# EasyEDA Pro project 1 Port AC Power Switch.eprj, schematic with Switch Detect

## Sheets
1 AC Power: Board Name: V3.0.1 Pro; Create Date: 2026-05-05; Page Name: AC Power; Project Name: 1 Port AC Power Switch; Schematic Name: with Switch Detect; Update Date: 2026-05-09
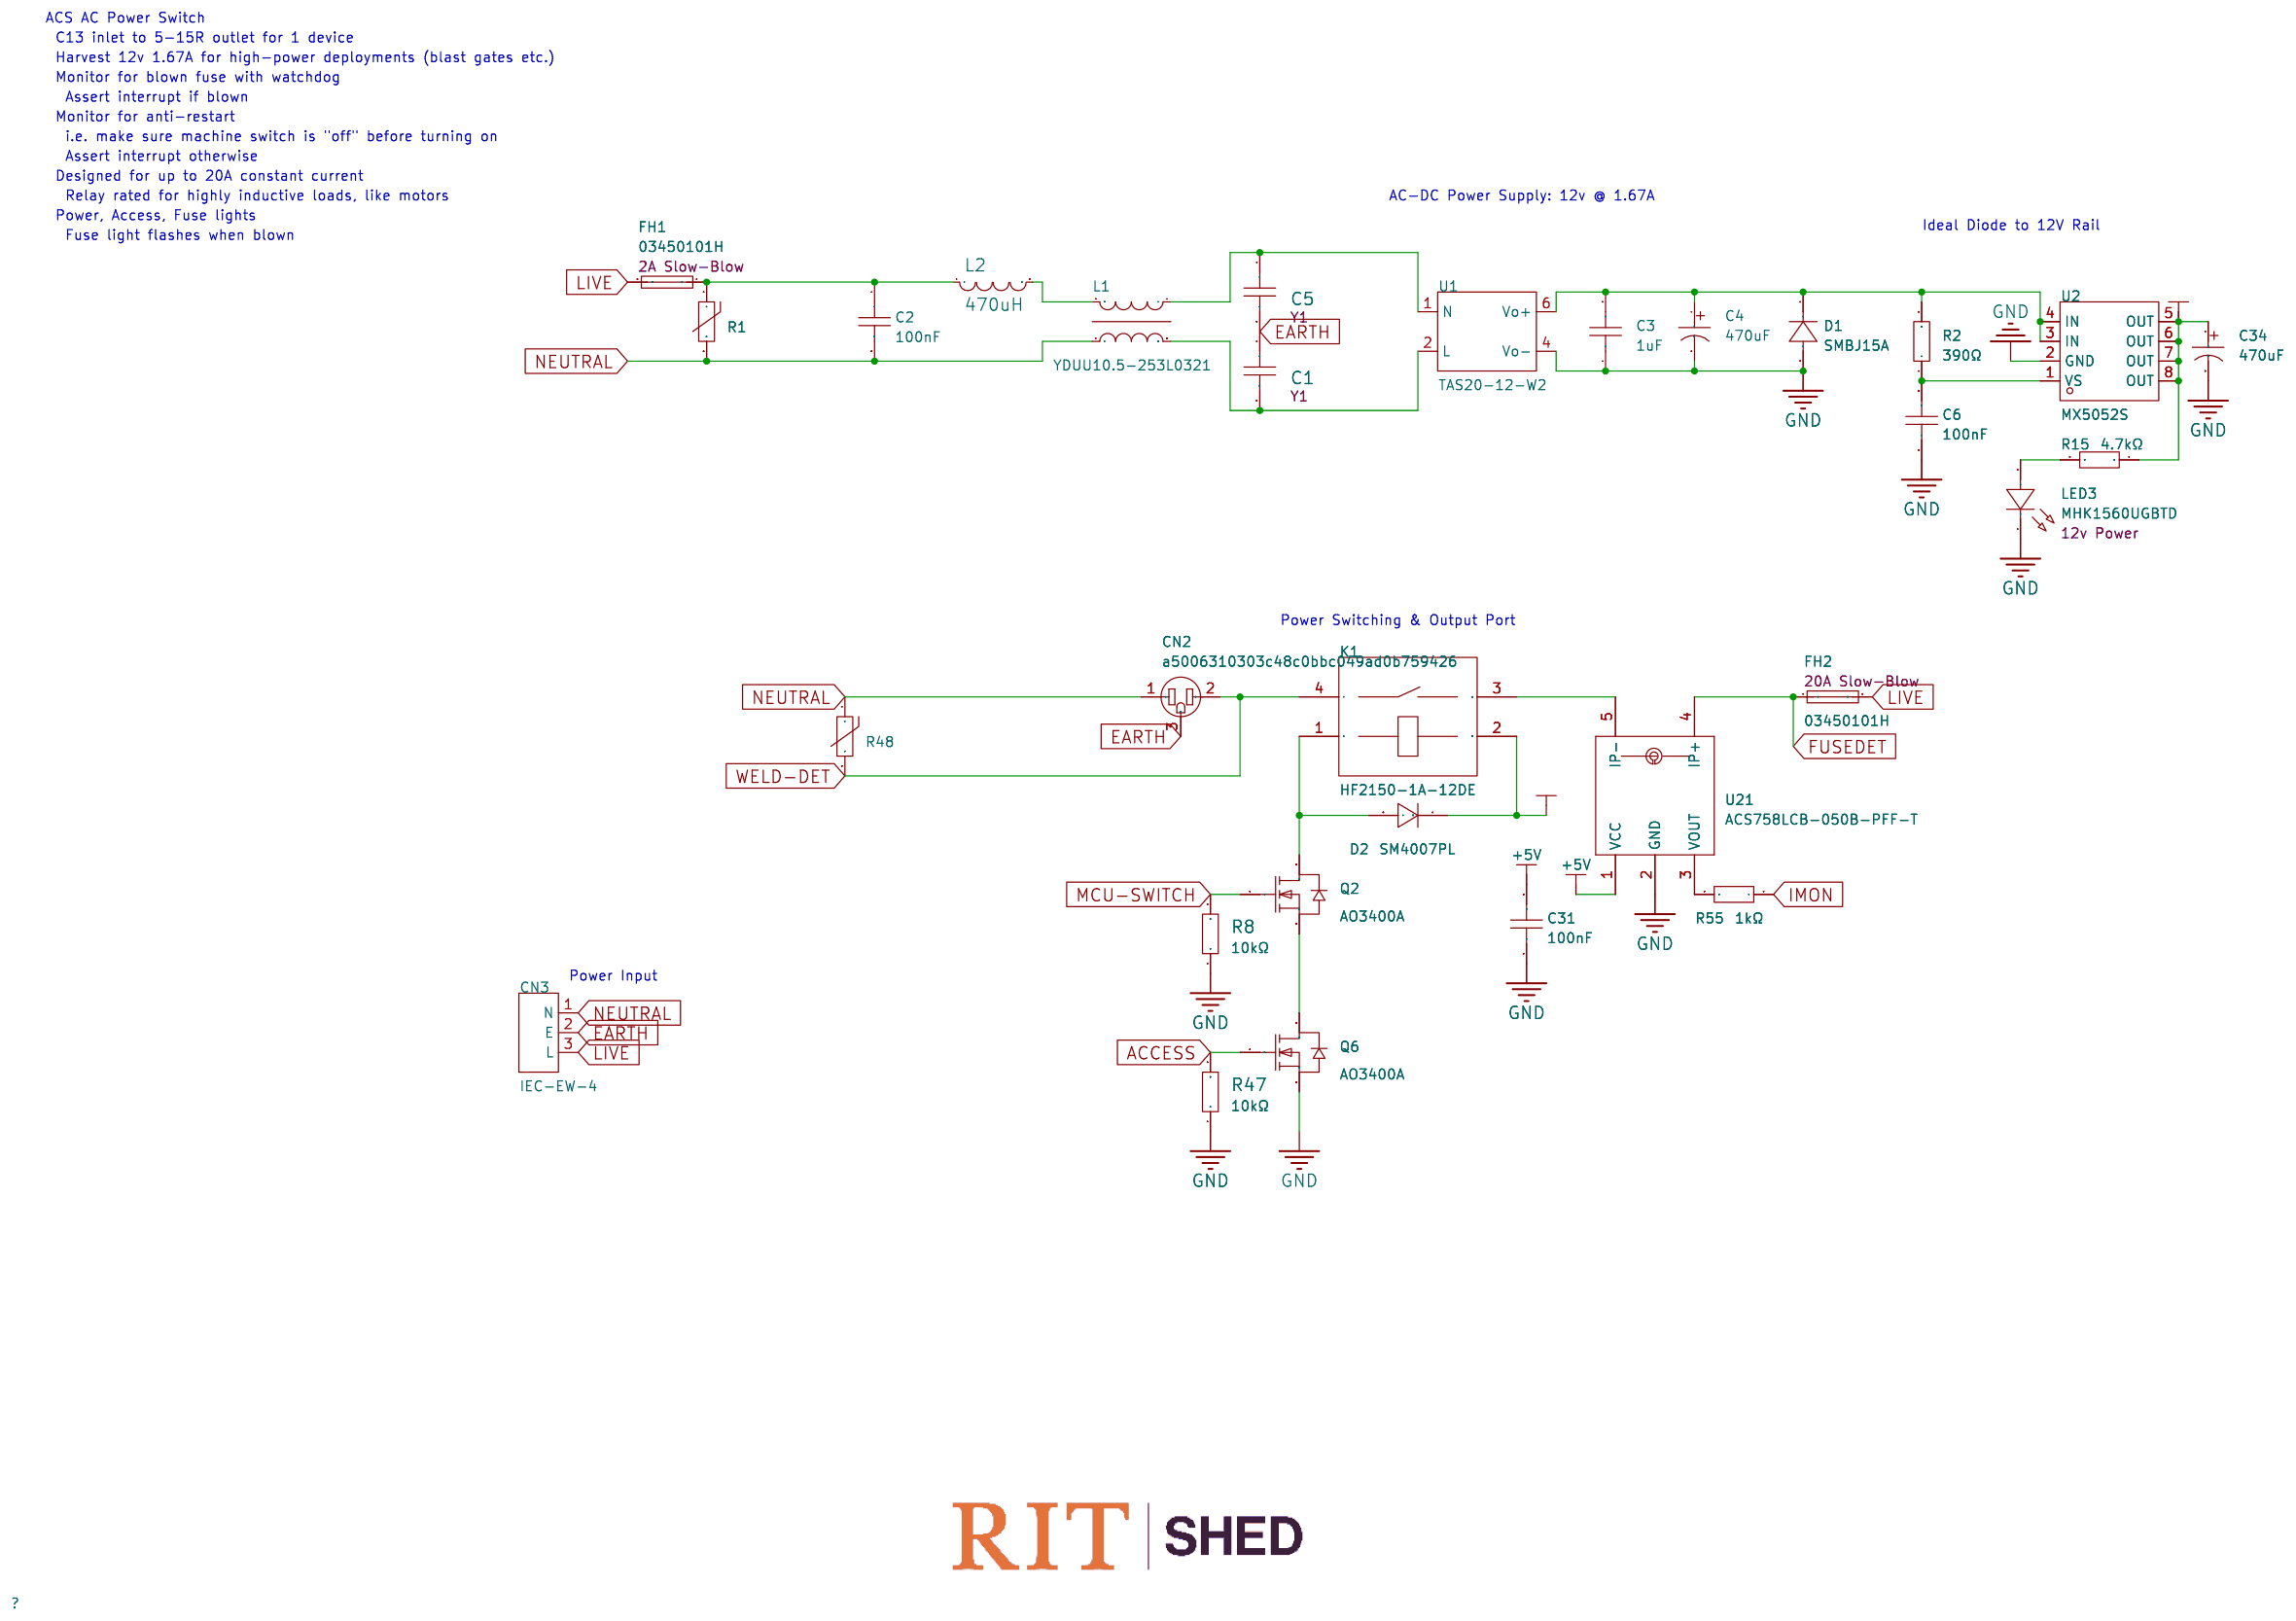
[diagram p2: AC Power]
2 Blown Fuse Detect: Page Name: Blown Fuse Detect; Update Date: 2026-05-07; Company: EasyEDA.com; Page Size: A4; Version: V1.0
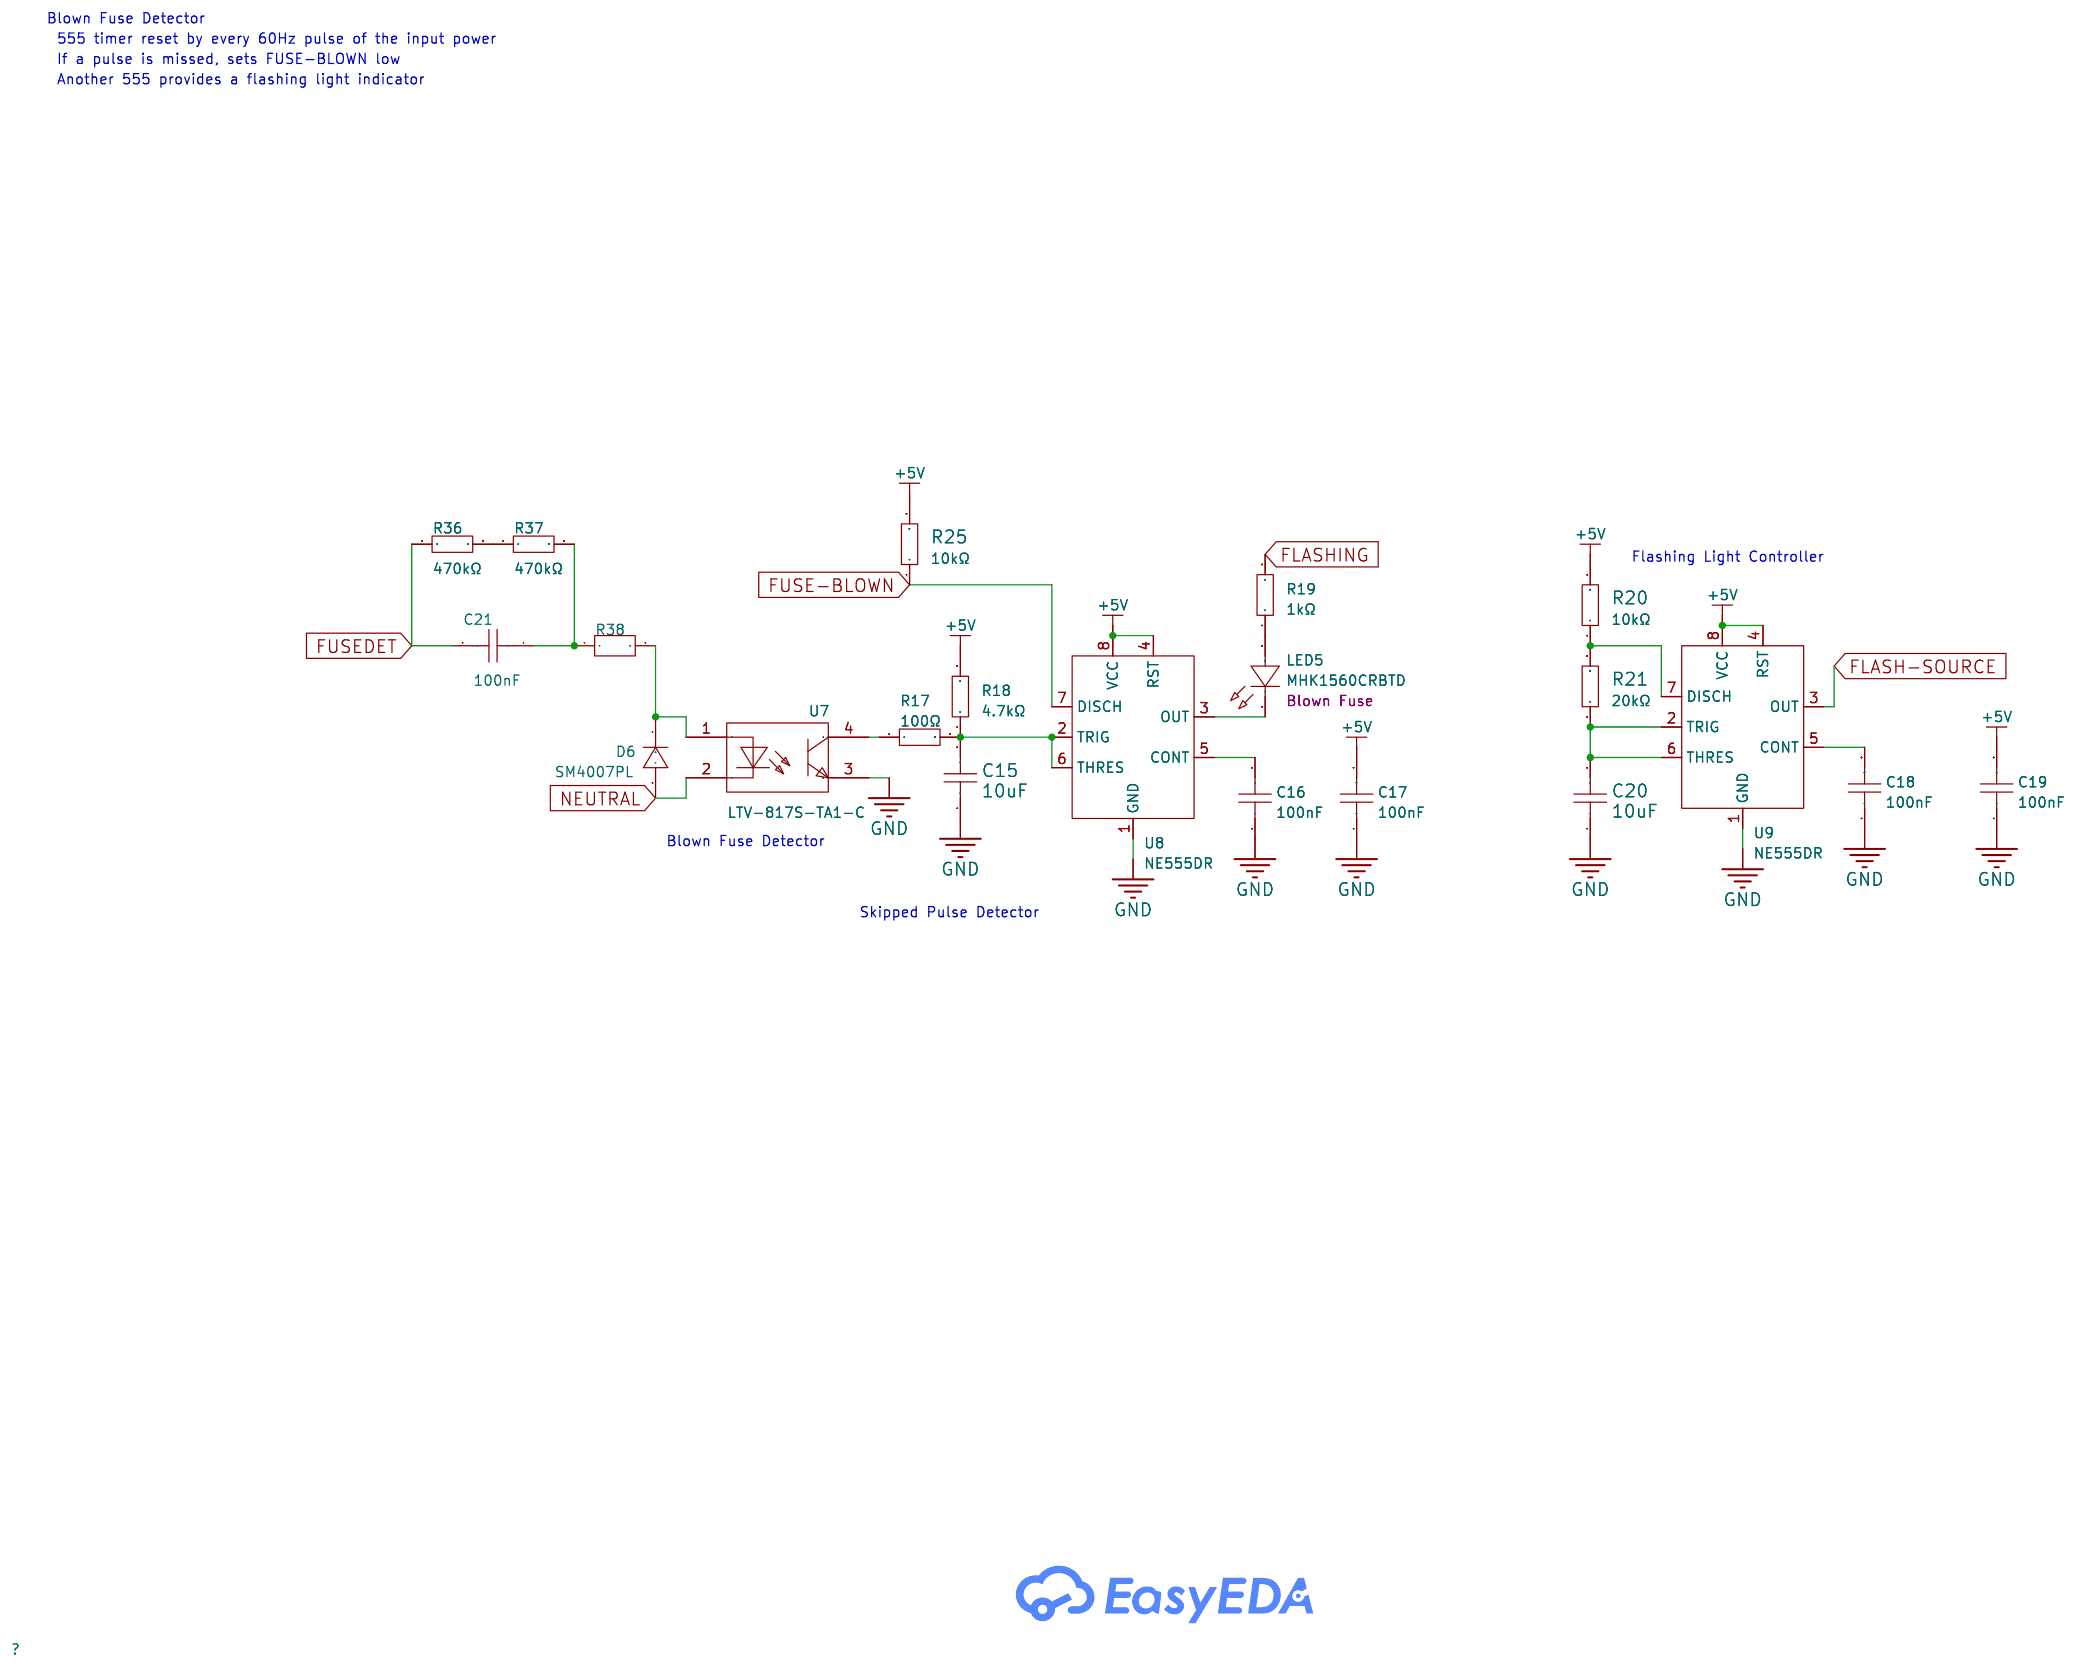
[diagram p3: Blown Fuse Detect]
3 Interfaces: Page Name: Interfaces; Company: EasyEDA.com; Page Size: A4; Version: V1.0
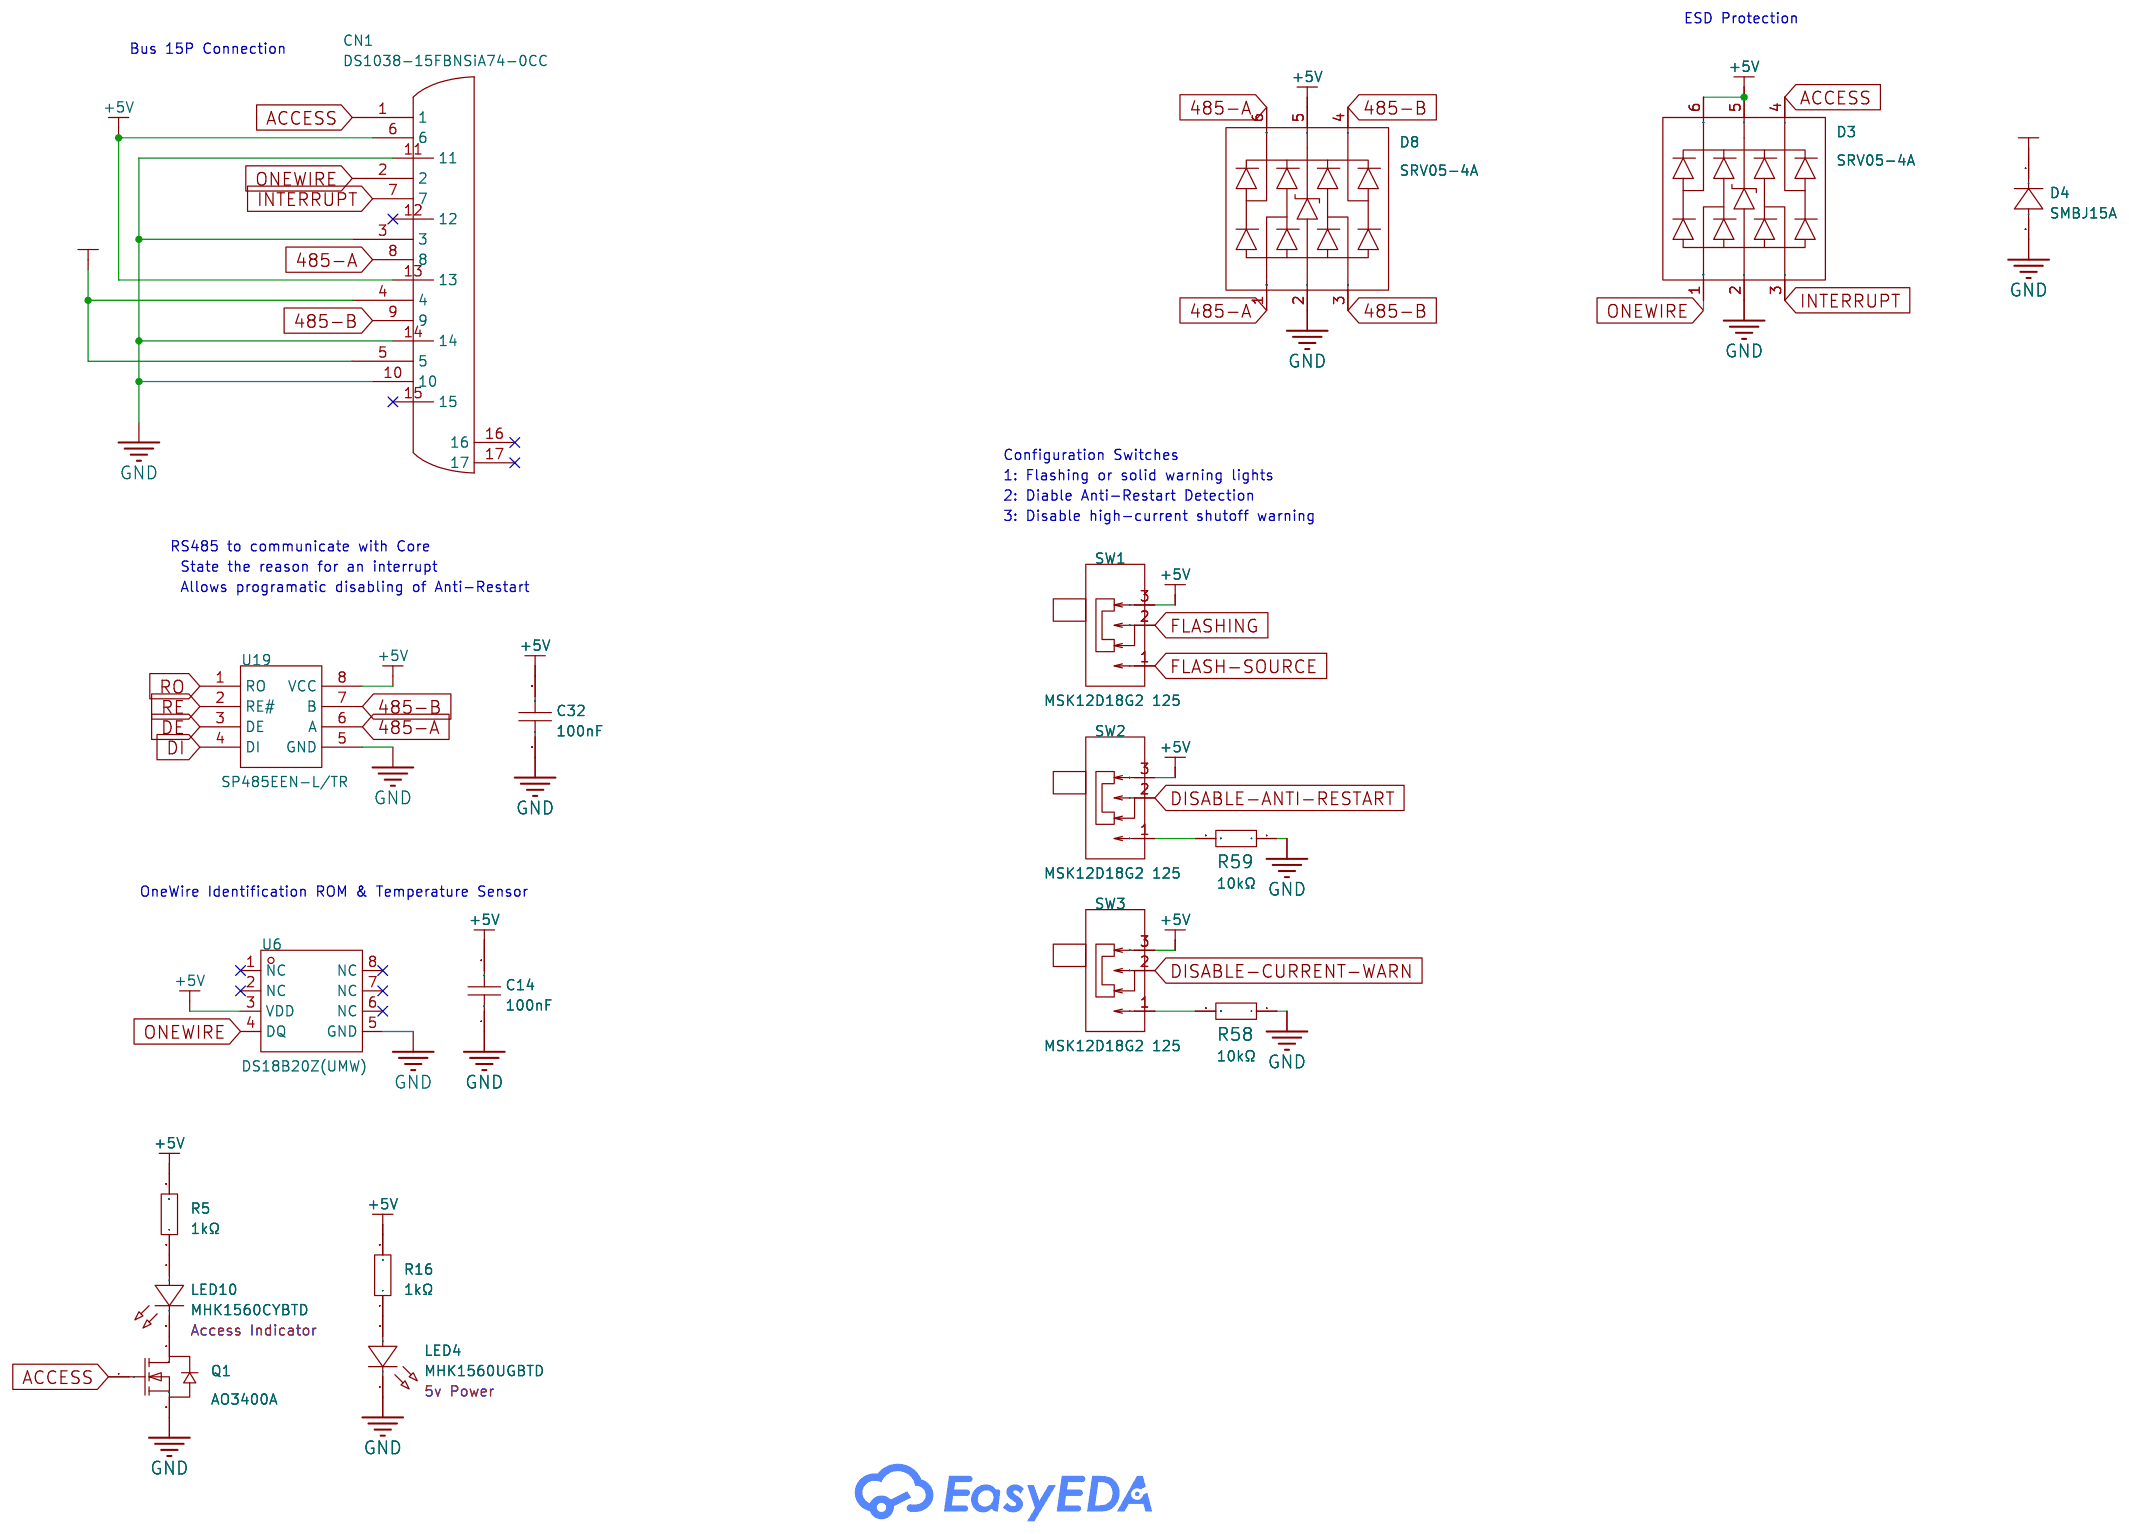
[diagram p4: Interfaces]
4 Control Logic: Page Name: Control Logic; Company: EasyEDA.com; Page Size: A4; Version: V1.0
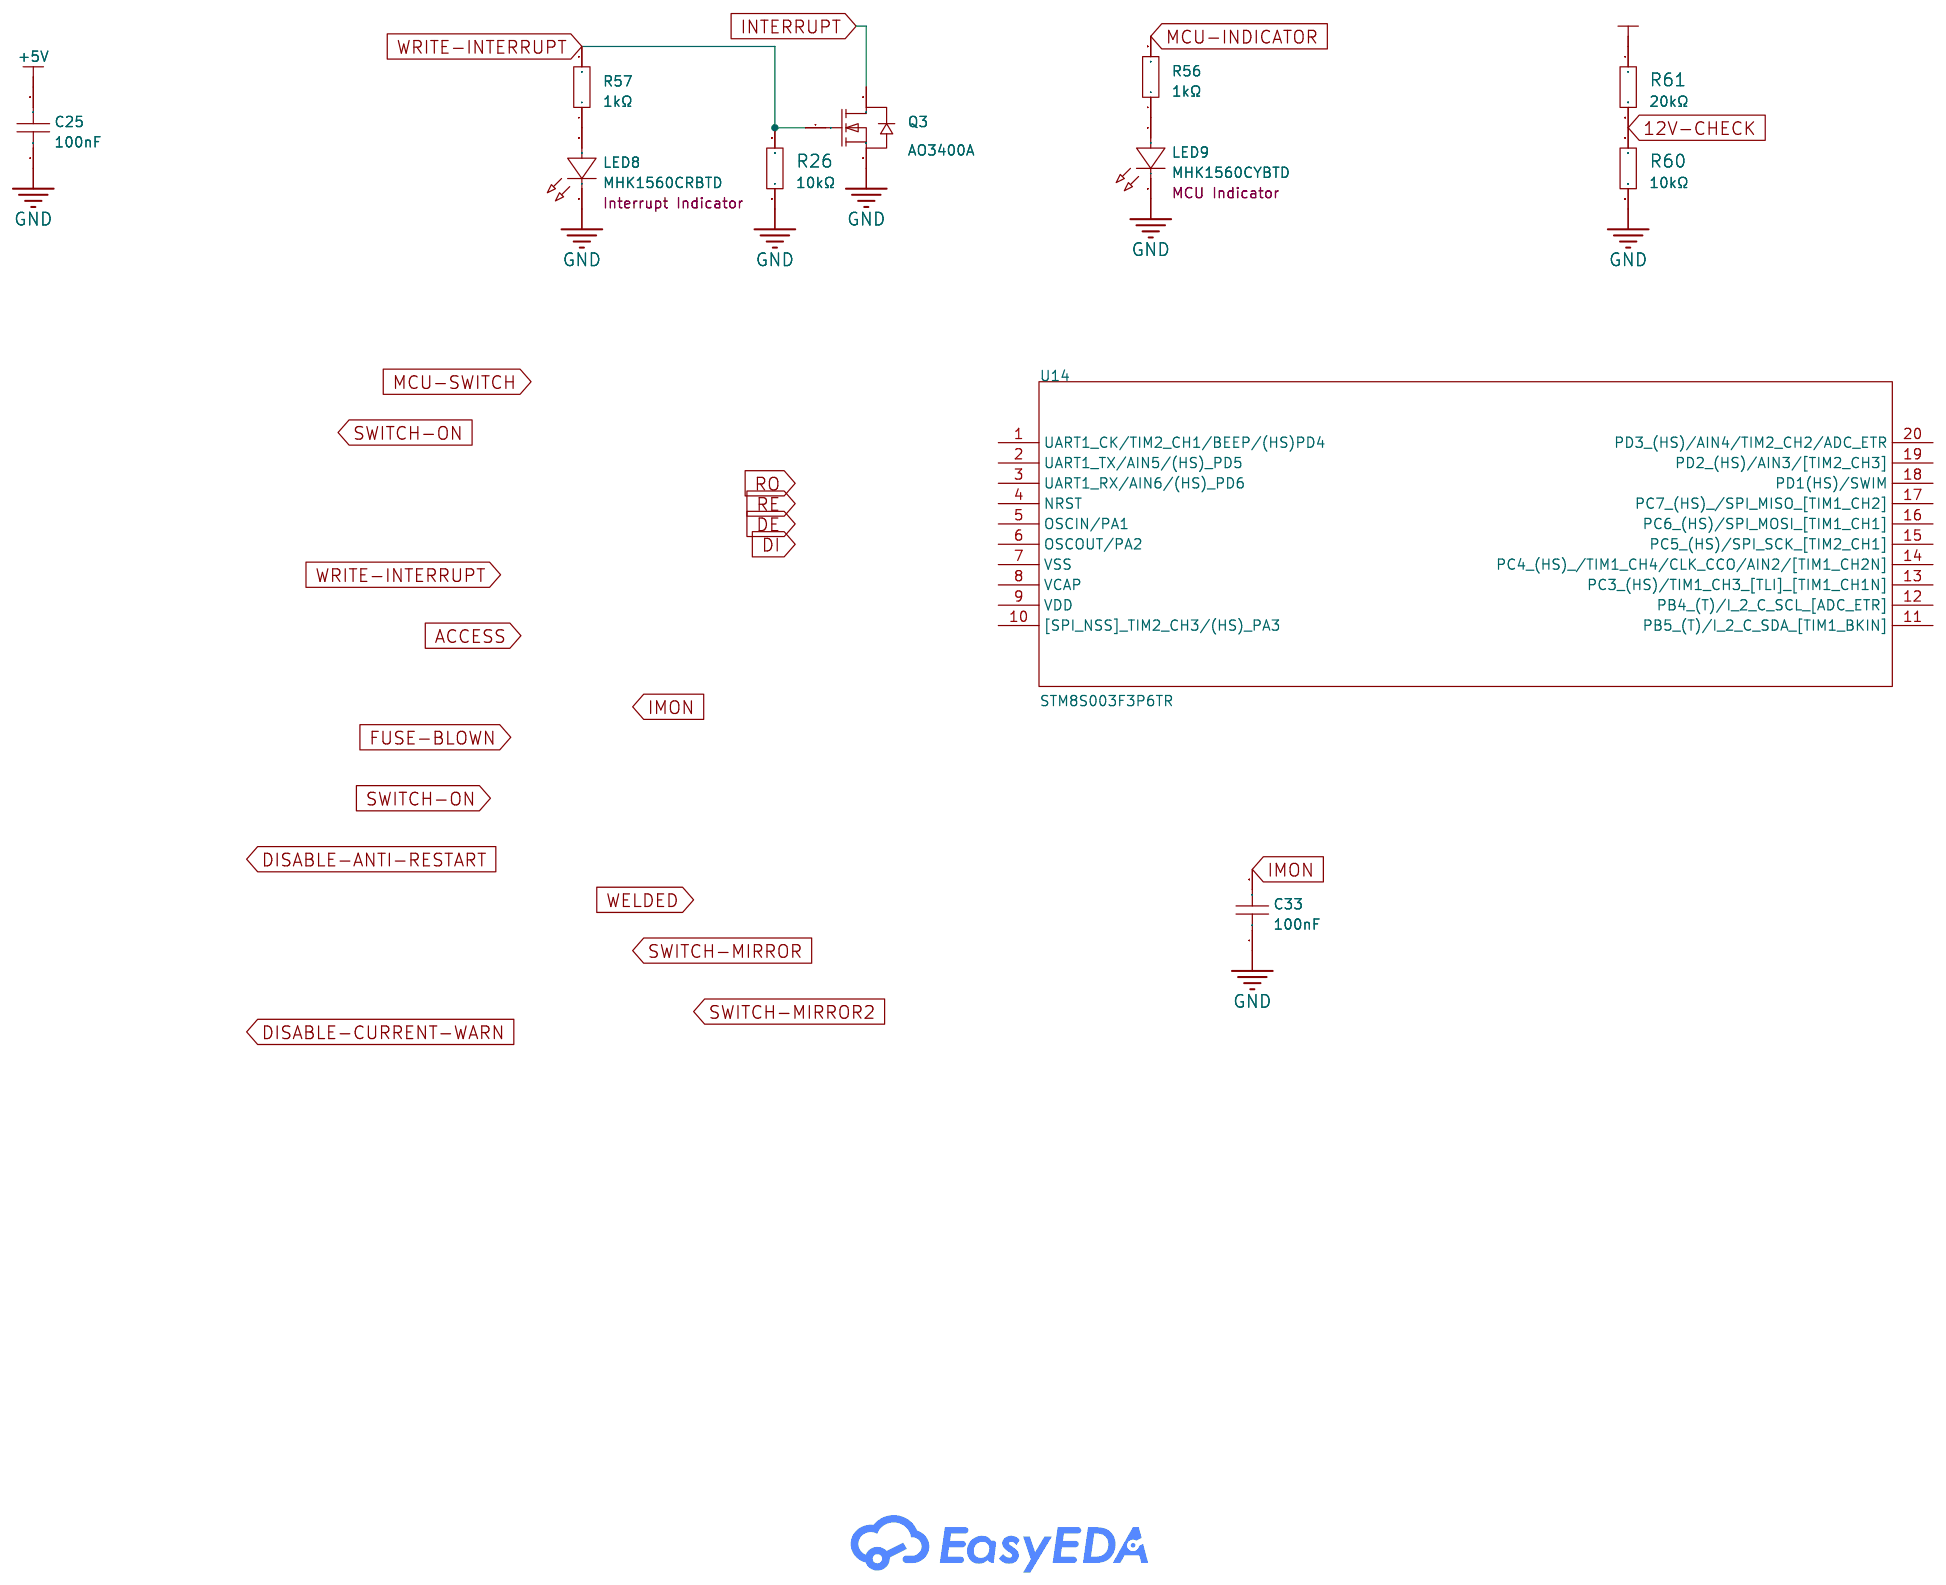
[diagram p5: Control Logic]
5 Anti-Restart Detect: Page Name: Anti-Restart Detect; Update Date: 2026-05-07; Company: EasyEDA.com; Page Size: A4; Version: V1.0
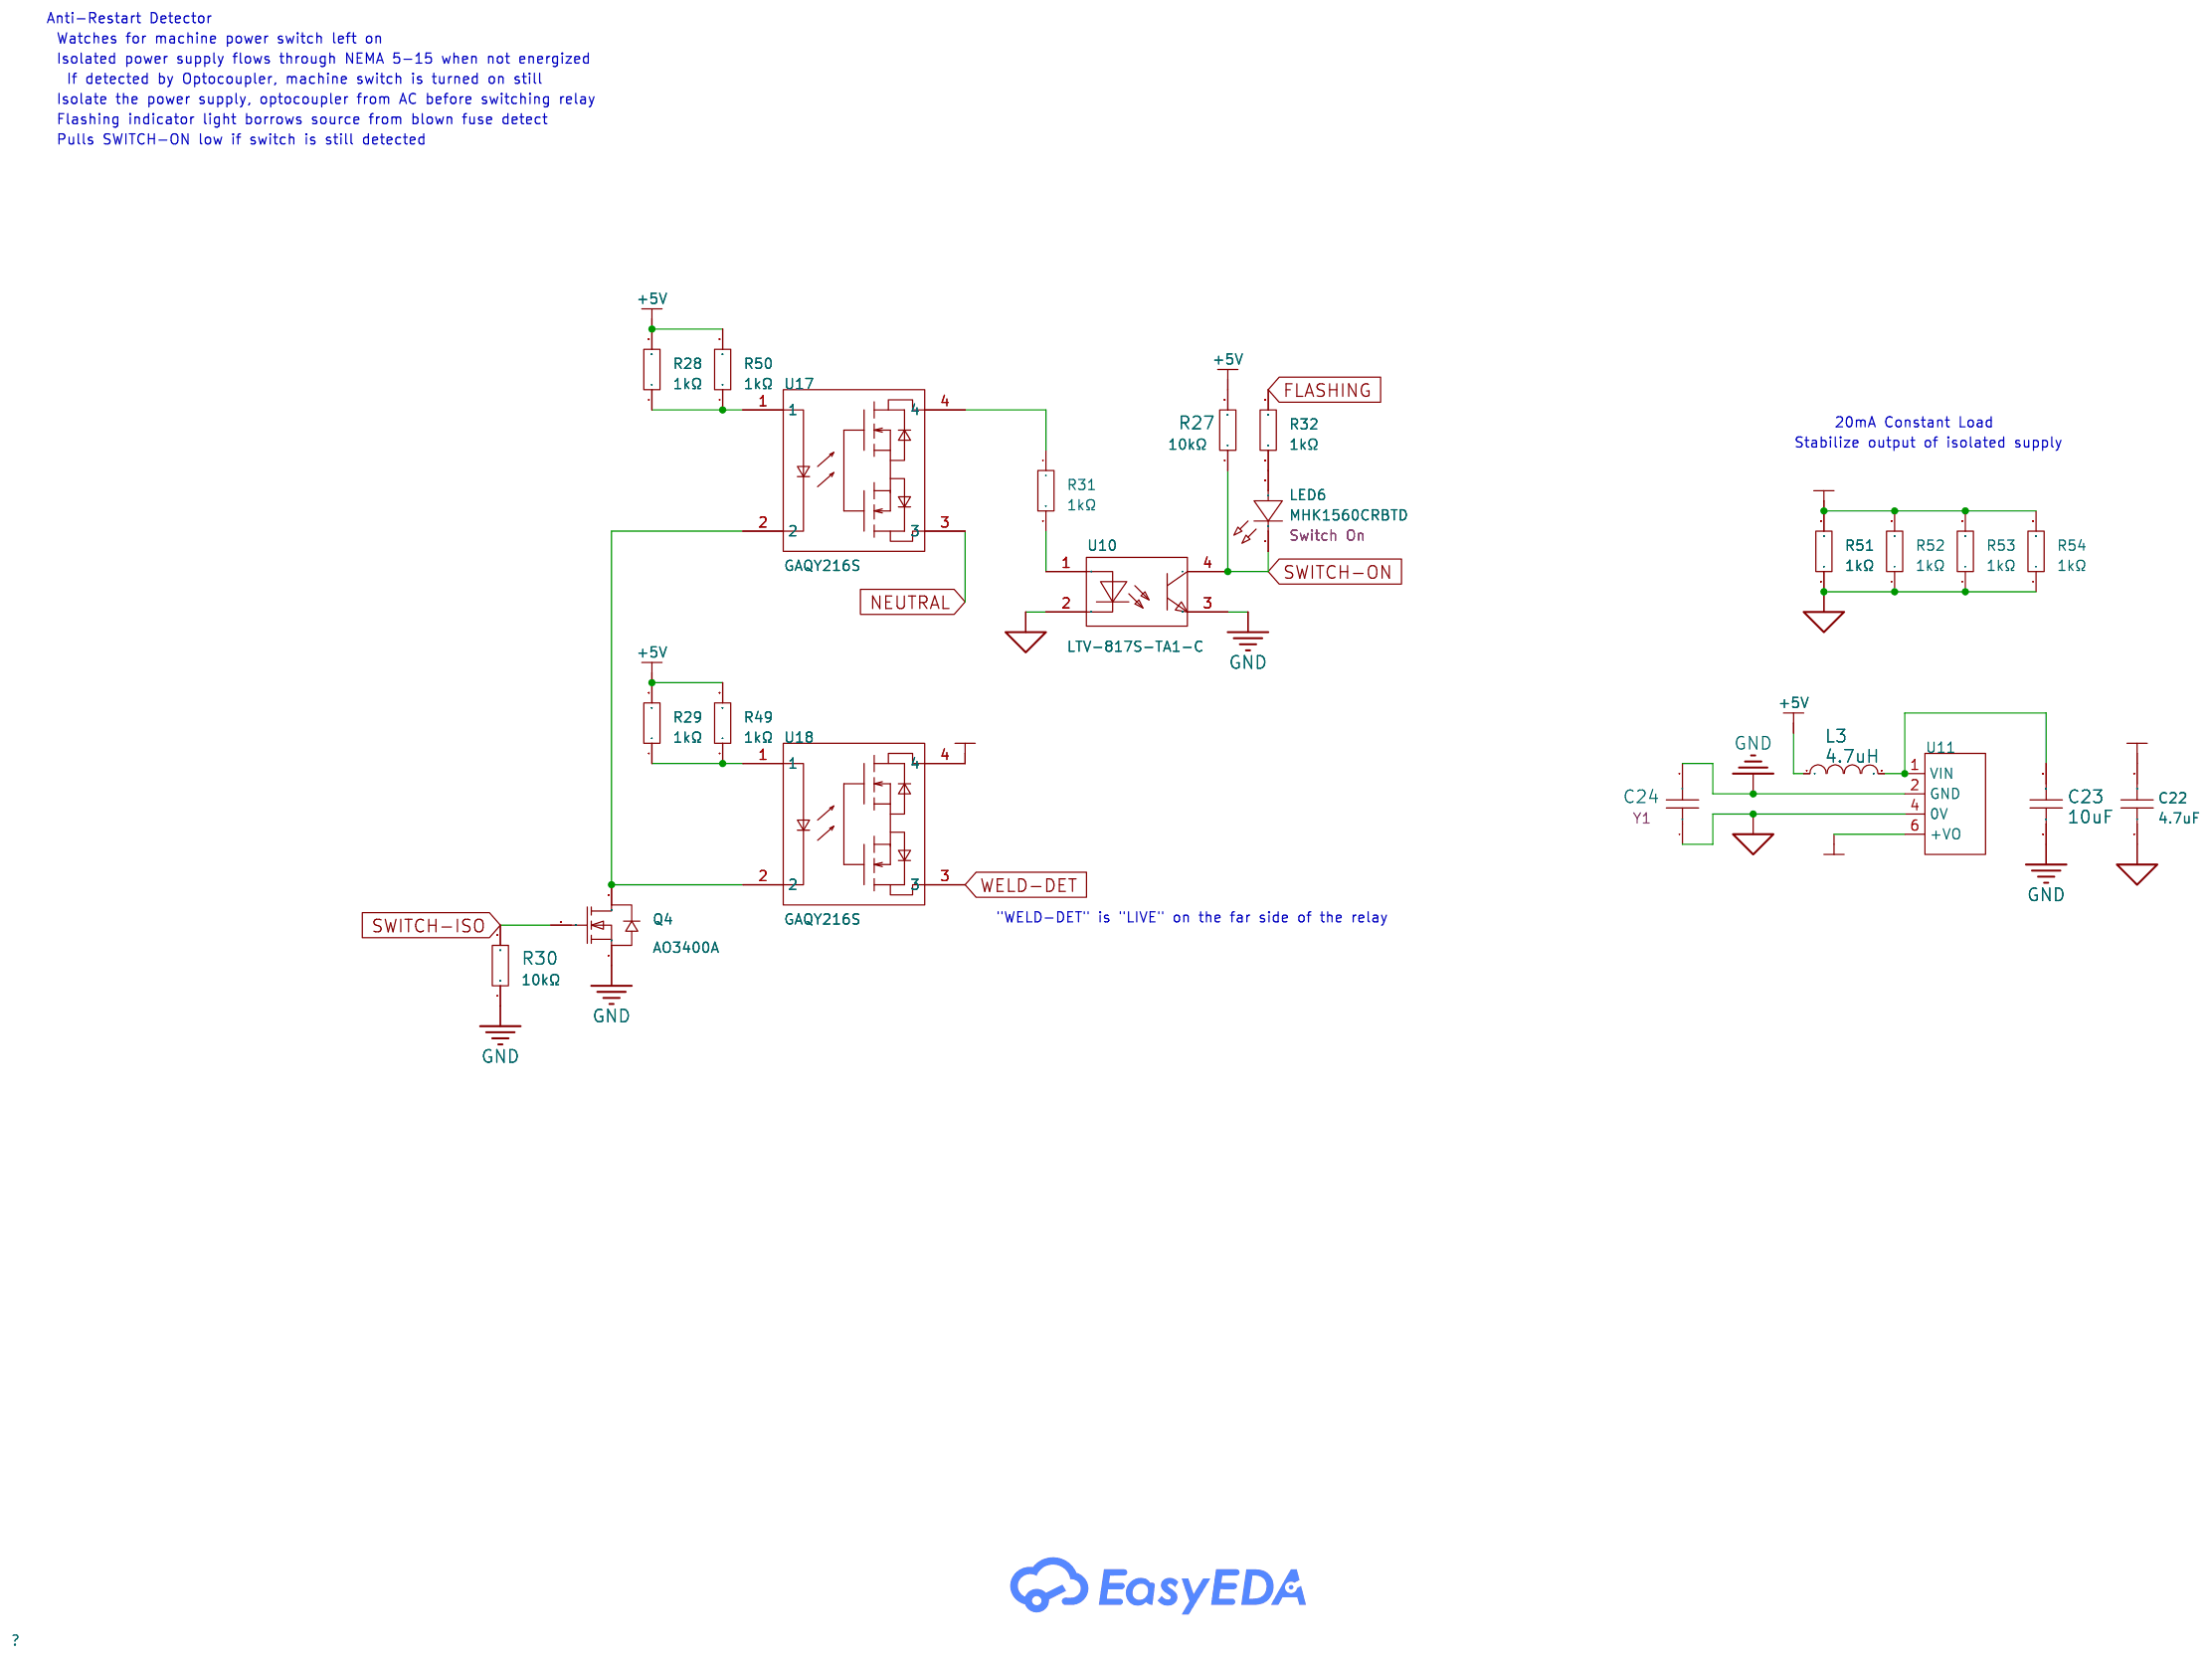
[diagram p6: Anti-Restart Detect]
6 Weld Contact Detect: Create Date: 2026-05-06; Page Name: Weld Contact Detect; Update Date: 2026-05-06; Company: EasyEDA.com; Page Size: A4; Version: V1.0
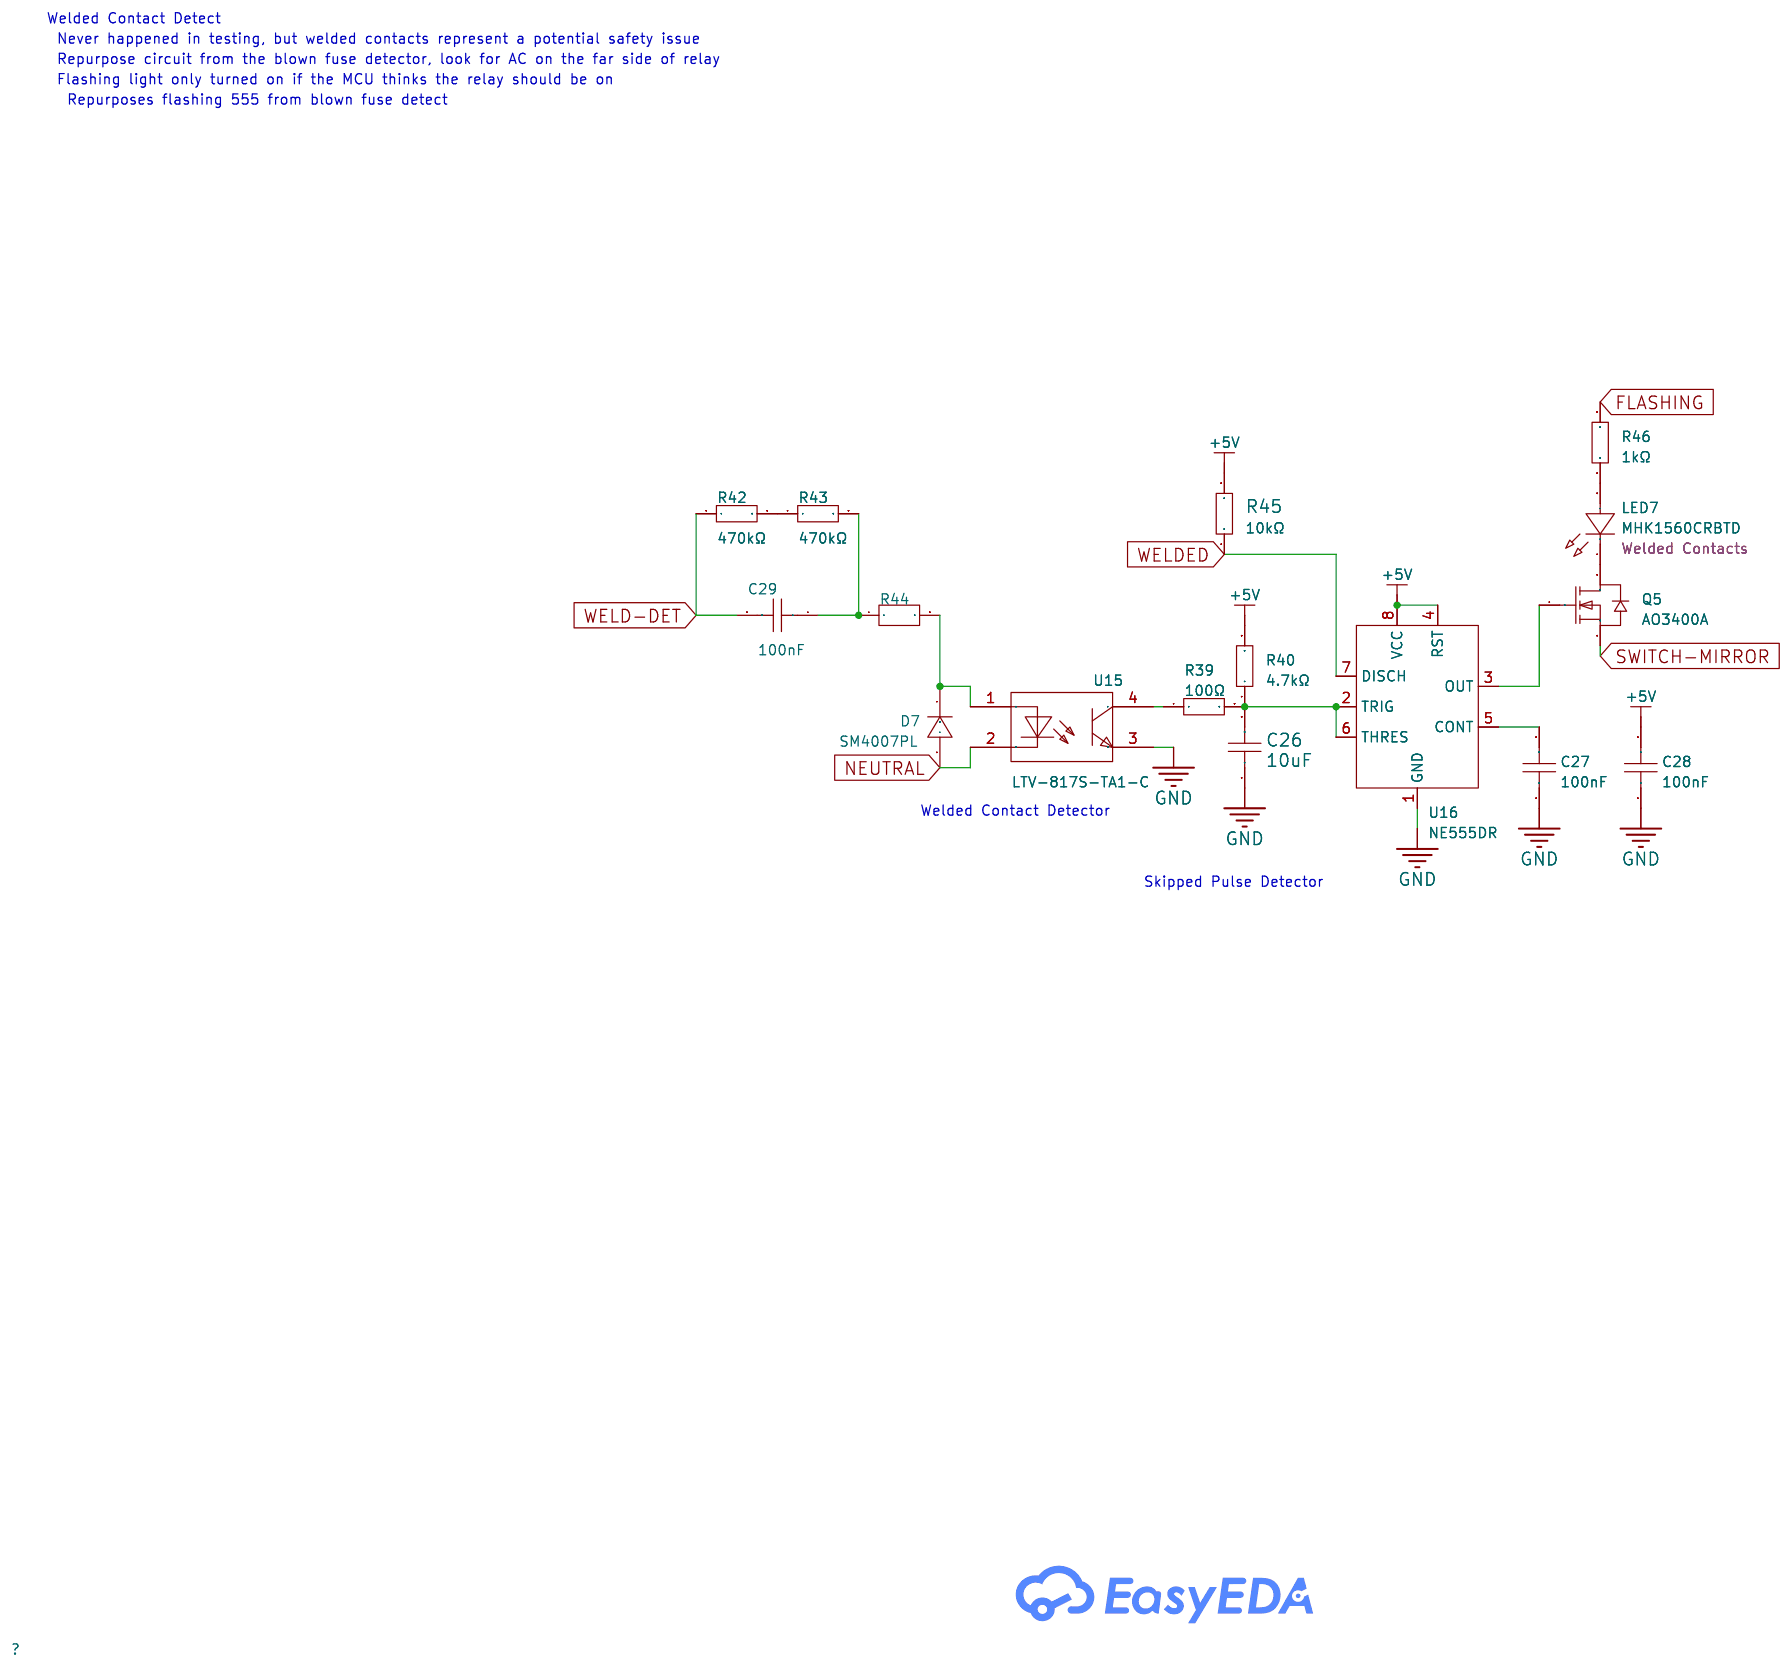
[diagram p7: Weld Contact Detect]

## Parts
sheet AC Power
C1  1nF  [CAP-TH_L8.5-W5.0-P10.00-D0.6]
C2  100nF  [CAP-TH_L10.0-W5.0-P7.50-D0.6]
C3  1uF  [C0603]
C4  470uF  [CAP-TH_BD10.0-P5.00-D1.0-FD]
C5  1nF  [CAP-TH_L8.5-W5.0-P10.00-D0.6]
C6  100nF  [C0603]
C31  100nF  [C0603]
C34  470uF  [CAP-TH_BD10.0-P5.00-D1.0-FD]
CN2  a5006310303c48c0bbc049ad0b759426  [739W-X2/32]
CN3  IEC-EW-4  [CONN-TH_IEC-EW-4]
D1  SMBJ15A  [SMB_L4.3-W3.6-LS5.3-RD]
D2  SM4007PL  [SOD-123F_L2.8-W1.8-LS3.7-RD]
FH1  03450101H  [03450101H]
FH2  03450101H  [03450101H]
K1  HF2150-1A-12DE  [RELAY-TH_HF2150-1A]
L1  YDUU10.5-253L0321  [IND-TH_4P-L19.0-W17.0]
L2  470uH  [IND-TH_BD9.0-P5.00-D0.7]
LED3  MHK1560UGBTD  [LED-TH_MHK1560UGBTD]
Q2  AO3400A  [SOT-23-3_L2.9-W1.3-P1.90-LS2.4-BR]
Q6  AO3400A  [SOT-23-3_L2.9-W1.3-P1.90-LS2.4-BR]
R1  210pF@1kHz  [RES-TH_L12.5-W5.1-P7.50-D1.2-S2.20]
R2  390Ω  [R0805]
R8  10kΩ  [R0603]
R15  4.7kΩ  [R0603]
R47  10kΩ  [R0603]
R48  210pF@1kHz  [RES-TH_L12.5-W5.1-P7.50-D1.2-S2.20]
R55  1kΩ  [R0603]
U1  TAS20-12-W2  [PWRM-TH_4P-L39.0-W25.0_TAS12-15-W2]
U2  MX5052S  [SOP-8_L4.9-W3.9-P1.27-LS6.0-BL]
U21  ACS758LCB-050B-PFF-T  [SENSOR-TH_ACS758LCB-050B-PFF-T]
sheet Anti-Restart Detect
C22  4.7uF  [C0603]
C23  10uF  [C0603]
C24  1nF  [CAP-TH_L8.5-W5.0-P10.00-D0.6]
L3  4.7uH  [L0805]
LED6  MHK1560CRBTD  [LED-TH_MHK1560UGBTD]
Q4  AO3400A  [SOT-23-3_L2.9-W1.3-P1.90-LS2.4-BR]
R27  10kΩ  [R0603]
R28  1kΩ  [R0603]
R29  1kΩ  [R0603]
R30  10kΩ  [R0603]
R31  1kΩ  [R0603]
R32  1kΩ  [R0603]
R49  1kΩ  [R0603]
R50  1kΩ  [R0603]
R51  1kΩ  [R0603]
R52  1kΩ  [R0603]
R53  1kΩ  [R0603]
R54  1kΩ  [R0603]
U10  LTV-817S-TA1-C  [OPTO-SMD-4_L4.6-W6.5-P2.54-LS10.3-BL]
U11  300kHz  [PWRM-TH_4P-L19.7-W6.0-P2.54]
U17  GAQY216S  [SOP-4_L4.3-W4.4-P2.54-LS6.8-TR]
U18  GAQY216S  [SOP-4_L4.3-W4.4-P2.54-LS6.8-TR]
sheet Blown Fuse Detect
C15  10uF  [C0603]
C16  100nF  [C0603]
C17  100nF  [C0603]
C18  100nF  [C0603]
C19  100nF  [C0603]
C20  10uF  [C0603]
C21  100nF  [CAP-TH_L10.0-W5.0-P7.50-D0.6]
D6  SM4007PL  [SOD-123F_L2.8-W1.8-LS3.7-RD]
LED5  MHK1560CRBTD  [LED-TH_MHK1560UGBTD]
R17  100Ω  [R0603]
R18  4.7kΩ  [R0603]
R19  1kΩ  [R0603]
R20  10kΩ  [R0603]
R21  20kΩ  [R0603]
R25  10kΩ  [R0603]
R36  470kΩ  [RES-TH_BD3.3-L9.0-P13.00-D0.6]
R37  470kΩ  [RES-TH_BD3.3-L9.0-P13.00-D0.6]
R38  4.7kΩ  [RES-TH_BD4.5-L11.0-P15.00-D0.7]
U7  LTV-817S-TA1-C  [OPTO-SMD-4_L4.6-W6.5-P2.54-LS10.3-BL]
U8  NE555DR  [SOIC-8_L4.9-W3.9-P1.27-LS6.0-BL]
U9  NE555DR  [SOIC-8_L4.9-W3.9-P1.27-LS6.0-BL]
sheet Control Logic
C25  100nF  [C0603]
C33  100nF  [C0603]
LED8  MHK1560CRBTD  [LED-TH_MHK1560UGBTD]
LED9  MHK1560CYBTD  [LED-TH_2P-L12.2-W6.0-P2.54_S530-A3]
Q3  AO3400A  [SOT-23-3_L2.9-W1.3-P1.90-LS2.4-BR]
R26  10kΩ  [R0603]
R56  1kΩ  [R0603]
R57  1kΩ  [R0603]
R60  10kΩ  [R0603]
R61  20kΩ  [R0603]
U14  STM8S003F3P6TR  [TSSOP-20_L6.5-W4.4-P0.65-LS6.4-BL]
sheet Interfaces
C14  100nF  [C0603]
C32  100nF  [C0603]
CN1  DS1038-15FBNSiA74-0CC  [DSUB-TH_DS1038-15FBNSIA74-0CC]
D3  SRV05-4A  [SOT-23-6_L2.9-W1.6-P0.95-LS2.9-BL]
D4  SMBJ15A  [SMB_L4.3-W3.6-LS5.3-RD]
D8  SRV05-4A  [SOT-23-6_L2.9-W1.6-P0.95-LS2.9-BL]
LED4  MHK1560UGBTD  [LED-TH_MHK1560UGBTD]
LED10  MHK1560CYBTD  [LED-TH_2P-L12.2-W6.0-P2.54_S530-A3]
Q1  AO3400A  [SOT-23-3_L2.9-W1.3-P1.90-LS2.4-BR]
R5  1kΩ  [R0603]
R16  1kΩ  [R0603]
R58  10kΩ  [R0603]
R59  10kΩ  [R0603]
SW1  MSK12D18G2 125  [SW-TH_MSK12D18G2]
SW2  MSK12D18G2 125  [SW-TH_MSK12D18G2]
SW3  MSK12D18G2 125  [SW-TH_MSK12D18G2]
U6  DS18B20Z(UMW)  [SOP-8_L4.9-W3.9-P1.27-LS6.0-BL]
U19  SP485EEN-L/TR  [SOIC-8_L5.0-W4.0-P1.27-LS6.0-BL]
sheet Weld Contact Detect
C26  10uF  [C0603]
C27  100nF  [C0603]
C28  100nF  [C0603]
C29  100nF  [CAP-TH_L10.0-W5.0-P7.50-D0.6]
D7  SM4007PL  [SOD-123F_L2.8-W1.8-LS3.7-RD]
LED7  MHK1560CRBTD  [LED-TH_MHK1560UGBTD]
Q5  AO3400A  [SOT-23-3_L2.9-W1.3-P1.90-LS2.4-BR]
R39  100Ω  [R0603]
R40  4.7kΩ  [R0603]
R42  470kΩ  [RES-TH_BD3.3-L9.0-P13.00-D0.6]
R43  470kΩ  [RES-TH_BD3.3-L9.0-P13.00-D0.6]
R44  4.7kΩ  [RES-TH_BD4.5-L11.0-P15.00-D0.7]
R45  10kΩ  [R0603]
R46  1kΩ  [R0603]
U15  LTV-817S-TA1-C  [OPTO-SMD-4_L4.6-W6.5-P2.54-LS10.3-BL]
U16  NE555DR  [SOIC-8_L4.9-W3.9-P1.27-LS6.0-BL]

## Library data of the parts
C1 C5 C24 = VY1102M31Y5UC63V0: LCSC Part Name: 等级:X1,Y1 1nF ±20% 760V; Supplier Part: C1620957; Manufacturer: VISHAY(威世); Supplier Footprint: 插件,P=10mm; JLCPCB Part Class: Extended Part; Datasheet: https://item.szlcsc.com/datasheet/VY1102M31Y5UC63V0/1711803.html; Supplier: LCSC; Tolerance: ±20%; Voltage(AC): 760V; Ratings: Y1; Operating Temperature: -40℃~+125℃
C2 C21 C29 = PX104K2C0702: LCSC Part Name: 等级:X2 100nF ±10% 310V 350V 380V; Supplier Part: C2693793; Manufacturer: KYET(科雅); Supplier Footprint: 插件,P=7.5mm; JLCPCB Part Class: Extended Part; Datasheet: https://item.szlcsc.com/datasheet/PX104K2C0702/2809868.html; Supplier: LCSC; Tolerance: ±10%; Voltage(AC): 310V；380V；350V; Ratings: X2; Operating Temperature: -40℃~+110℃
C3 = CL10A105KB8NNNC: LCSC Part Name: 1uF ±10% 50V; Supplier Part: C15849; Manufacturer: SAMSUNG(三星); Supplier Footprint: 0603; JLCPCB Part Class: Basic Part; Datasheet: https://item.szlcsc.com/datasheet/CL10A105KB8NNNC/16531.html; Supplier: LCSC; Tolerance: ±10%; Voltage Rating: 50V; Temperature Coefficient: X5R
C4 C34 = KM477M025G13RR0VH2FP0: LCSC Part Name: 470uF ±20% 25V; Supplier Part: C44594; Manufacturer: Chengx(承兴); Supplier Footprint: 插件,D10xL13mm; JLCPCB Part Class: Extended Part; Datasheet: https://item.szlcsc.com/datasheet/KM477M025G13RR0VH2FP0/45596.html; Supplier: LCSC; Tolerance: ±20%; Voltage Rating: 25V; Pin Spacing: 5mm; Diameter: 10mm; Height - Seated (Max): 13mm; Lifetime: 2000hrs@105℃
C6 C14 C16-C19 C25 C27 C28 C31-C33 = CC0603KRX7R9BB104: LCSC Part Name: 100nF ±10% 50V; Supplier Part: C14663; Manufacturer: YAGEO(国巨); Supplier Footprint: 0603; Datasheet: https://item.szlcsc.com/datasheet/CC0603KRX7R9BB104/15331.html; Supplier: LCSC; Tolerance: ±10%; Voltage Rating: 50V; Temperature Coefficient: X7R
CN2 = 739W-X2/32
CN3 = IEC-EW-4: Supplier Part: C17684530; Manufacturer: ADAM TECH; Datasheet: https://item.szlcsc.com/datasheet/IEC-EW-4/18813803.html; Supplier: LCSC
D1 D4 = SMBJ15A_C19077569: LCSC Part Name: 单向TVS 15V截止 峰值浪涌电流：24.59A@10/1000us; Supplier Part: C19077569; Manufacturer: R+O(宏嘉诚); Supplier Footprint: DO-214AA(SMB); JLCPCB Part Class: Extended Part; Datasheet: https://item.szlcsc.com/datasheet/SMBJ15A/20275654.html; Supplier: LCSC; Polarity: Unidirectional; Reverse Stand-Off Voltage (Vrwm): 15V; Clamping Voltage: 24.4V; Peak Pulse Current (Ipp): 24.59A@10/1000us; Peak Pulse Power Dissipation (Ppp): 600W@10/1000us; Voltage - Breakdown: 18.5V; Reverse Leakage Current (Ir): 5uA; Operating Temperature: -55℃~+150℃; level of protection: IEC 61000-4-2; Type: TVS
D2 D6 D7 = SM4007PL_C64898: LCSC Part Name: 1kV 1A; Supplier Part: C64898; Manufacturer: MDD(辰达半导体); Supplier Footprint: SOD-123FL; Datasheet: https://item.szlcsc.com/datasheet/SM4007PL/65968.html; Supplier: LCSC; Diode Configuration: Independent; Voltage - Forward(Vf@If): 1.1V@1A; Voltage - DC Reverse(Vr): 1kV; Current - Rectified: 1A; Reverse Leakage Current (Ir): 10uA@1kV; Non-Repetitive Peak Forward Surge Current: 25A; Operating Junction Temperature Range: -55℃~+150℃
FH1 = 03450101H: LCSC Part Name: 20A 600V; Supplier Part: C206934; Manufacturer: Littelfuse(美国力特); Datasheet: https://item.szlcsc.com/datasheet/03450101H/208053.html; Supplier: LCSC; Number of Circuits: 1; Voltage Rating: 600V; Current Rating: 20A; Fuse Type: Cylindrical; Fuse Diameter (φD): 6.35mm; Fuse Length: 32mm; Note: 2A Slow-Blow
FH2 = 03450101H: LCSC Part Name: 20A 600V; Supplier Part: C206934; Manufacturer: Littelfuse(美国力特); Datasheet: https://item.szlcsc.com/datasheet/03450101H/208053.html; Supplier: LCSC; Number of Circuits: 1; Voltage Rating: 600V; Current Rating: 20A; Fuse Type: Cylindrical; Fuse Diameter (φD): 6.35mm; Fuse Length: 32mm; Note: 20A Slow-Blow
K1 = HF2150-1A-12DE: LCSC Part Name: 小型大功率12V继电器 单刀单掷-常开; Supplier Part: C32863; Manufacturer: HF(宏发); Supplier Footprint: 插件,31.8x27mm; JLCPCB Part Class: Extended Part; Datasheet: https://item.szlcsc.com/datasheet/HF2150-1A-12DE/33828.html; Supplier: LCSC; Coil Voltage: 12V; Contact Form: 1 Set Normally Open: 1A (SPST NO); Number of Pins: 5; Contact Rating: 30A@240VAC；20A@30VDC; Switching Voltage(Max): 277V@AC；30V@DC; Coil Rated Power: 900mW; Contact Material: AgCdO; Switching Current(Max): 40A; Coil Type: Non-Polarized - Single Coil; Coil Resistance: 155Ω; Contact Resistance: 50mΩ; Operate Time: 15ms; Release Time: 10ms; Operating Temperature: -55℃~+85℃
L1 = YDUU10.5-253L0321: LCSC Part Name: UU10.5 25mH @1KHz; Supplier Part: C5200263; Manufacturer: YJYCOIN(益嘉源); Supplier Footprint: 插件,19x17mm; JLCPCB Part Class: Extended Part; Datasheet: https://item.szlcsc.com/datasheet/YDUU10.5-253L0321/5887401.html; Supplier: LCSC; Number of Lines: 2; Inductance @ Frequency: 25mH@1KHz; Voltage Withstand: 1.5kV@AC
L2 = PK0810-471MB: LCSC Part Name: 470uH ±20%; Supplier Part: C400319; Manufacturer: SXN(顺翔诺); Supplier Footprint: 插件,D10xL13mm; JLCPCB Part Class: Extended Part; Datasheet: https://item.szlcsc.com/datasheet/PK0810-471MB/384150.html; Supplier: LCSC; Tolerance: ±20%; Current Rating: 420mA; DC Resistance(DCR): 800mΩ; Type: Unshielded Inductor
LED3 = MHK1560UGBTD: Emitted Color:Emerald Forward Voltage (VF):1.75V~2.2V Forward Voltage (VF):1.75V~2.2V Forward Current:20mA Dominant Wavelength:520nm Dominant Wavelength:520nm Lens Color:雾状绿透镜 Luminous Intensity:1000mcd Luminous Intensity:1000mcd Viewing Angle:85° Operati; LCSC Part Name: 1560直插单灯翠绿色光; Supplier Part: C7470833; Manufacturer: MEIHUA(美华); Supplier Footprint: 插件,P=2.54mm; JLCPCB Part Class: Extended Part; Datasheet: https://atta.szlcsc.com/upload/public/pdf/source/20231114/0151DB1F997DCF286213A722D08B4BAA.pdf; Supplier: LCSC; Emitted Color: Emerald; Forward Voltage (VF): 1.75V~2.2V; Forward Current: 20mA; Dominant Wavelength: 520nm; Lens Color: 雾状绿透镜; Luminous Intensity: 1000mcd; Viewing Angle: 85°; Operating Temperature: -40℃~+85℃; Note: 12v Power
Q1-Q6 = AO3400A_C20917: LCSC Part Name: 1个N沟道 耐压:30V 电流:5.7A; Supplier Part: C20917; Manufacturer: AOS; Supplier Footprint: SOT-23-3L; Datasheet: https://item.szlcsc.com/datasheet/AO3400A/21629.html; Supplier: LCSC; Drain to Source Voltage: 30V; RDS(on): 48mΩ@2.5V; Gate Threshold Voltage (Vgs(th)): 1.45V@250uA; Gate Charge(Qg): 7nC@10V; Input Capacitance(Ciss): 630pF@15V; Operating Temperature: -55℃~+150℃@(Tj); Type: N-Channel
R1 R48 = VDR-10D471K: LCSC Part Name: 钳位电压775V 67焦耳 插件压敏电阻; Supplier Part: C316609; Manufacturer: VDR(嵩隆); Supplier Footprint: 插件,P=7.5mm; JLCPCB Part Class: Extended Part; Datasheet: https://item.szlcsc.com/datasheet/VDR-10D471K/298277.html; Supplier: LCSC; Varistor Voltage: 423V~517V; Clamping Voltage: 775V; Maximum DC Volts: 385V; Maximum AC Volts: 300V; Peak Current: 2.5kA; Energy: 67J; Rated Wattage: 400mW
R2 = 0805W8F3900T5E: Type:Thick Film Resistor Resistance:390Ω Tolerance:±1% Tolerance:±1% Power(Watts):125mW Voltage-Supply(Max):150V Temperature Coefficient:±100ppm/℃ Temperature Coefficient:±100ppm/℃ Operating Temperature:-55℃~+155℃ Operating Temperature:-55℃~+155℃; LCSC Part Name: 390Ω ±1% 125mW 厚膜电阻; Supplier Part: C17655; Manufacturer: UNI-ROYAL(厚声); Supplier Footprint: 0805; Datasheet: https://item.szlcsc.com/datasheet/0805W8F3900T5E/18343.html; Supplier: LCSC; Type: Thick Film Resistor; Tolerance: ±1%; Power(Watts): 125mW; Voltage-Supply(Max): 150V; Temperature Coefficient: ±100ppm/℃; Operating Temperature: -55℃~+155℃
R8 R20 R25-R27 R30 R45 R47 R58-R60 = 0603WAF1002T5E: LCSC Part Name: 厚膜电阻 10kΩ ±1% 100mW; Supplier Part: C25804; Manufacturer: UNI-ROYAL(厚声); Supplier Footprint: 0603; JLCPCB Part Class: Basic Part; Datasheet: https://item.szlcsc.com/datasheet/0603WAF1002T5E/26547.html; Supplier: LCSC; Type: Thick Film Resistor; Tolerance: ±1%; Power(Watts): 100mW; Voltage-Supply(Max): 75V; Temperature Coefficient: ±100ppm/℃; Operating Temperature: -55℃~+155℃
R15 R18 R40 = 0603WAF4701T5E: LCSC Part Name: 4.7kΩ ±1% 100mW 厚膜电阻; Supplier Part: C23162; Manufacturer: UNI-ROYAL(厚声); Supplier Footprint: 0603; Datasheet: https://item.szlcsc.com/datasheet/0603WAF4701T5E/23889.html; Supplier: LCSC; Type: Thick Film Resistor; Tolerance: ±1%; Power(Watts): 100mW; Voltage-Supply(Max): 75V; Temperature Coefficient: ±100ppm/℃; Operating Temperature: -55℃~+155℃
R5 R16 R19 R28 R29 R31 R32 R46 R49-R57 = 0603WAF1001T5E: LCSC Part Name: 1kΩ ±1% 100mW 厚膜电阻; Supplier Part: C21190; Manufacturer: UNI-ROYAL(厚声); Supplier Footprint: 0603; Datasheet: https://item.szlcsc.com/datasheet/0603WAF1001T5E/21904.html; Supplier: LCSC; Type: Thick Film Resistor; Tolerance: ±1%; Power(Watts): 100mW; Voltage-Supply(Max): 75V; Temperature Coefficient: ±100ppm/℃; Operating Temperature: -55℃~+155℃
U1 = TAS20-12-W2: LCSC Part Name: 小体积AC-DC电源模块; Supplier Part: C39846906; Manufacturer: TDPOWER(腾达电源); Supplier Footprint: 插件,39x25mm; JLCPCB Part Class: Extended Part; Datasheet: https://item.szlcsc.com/datasheet/TAS20-12-W2/41578643.html; Supplier: LCSC; Conversion Type: AC/DC-DC; Number of Outputs: 1; Voltage - Input(DC): 100V~370V; Voltage - Input(AC): 85VAC~265VAC; Output Voltage: 12V; Output Voltage Accuracy: ±2%; Output Current(Max): 1.67A; Output Power: 20W; Quiescent Dissipation: 0.15W; Conversion Efficiency: 88%; Ripple Noise: 100mVp-p; Capacitive Load(Max): 3300uF; Features: Over Current Protection；Short Circuit Protection; Isolation Voltage(Vrms): 2.5kV; Length: 39mm; Width: 25mm; Height: 21mm; Switching Frequency: 100kHz
U2 = MX5052S: LCSC Part Name: 集成MOS Oring控制器; Supplier Part: C5875696; Manufacturer: Wuxi Maxinmicro(无锡明芯微); Supplier Footprint: SOP-8; JLCPCB Part Class: Extended Part; Datasheet: https://item.szlcsc.com/datasheet/MX5052S/6809525.html; Supplier: LCSC
U21 = ACS758LCB-050B-PFF-T_C6396157: LCSC Part Name: 开环式高精度线性电流传感器; Supplier Part: C6396157; Manufacturer: JSMSEMI(杰盛微); Supplier Footprint: CB-2-3; Datasheet: https://item.szlcsc.com/datasheet/ACS758LCB-050B-PFF-T/7347280.html; Supplier: LCSC; Current Range: ±50A; Voltage - Supply: 4.5V~5.5V; Isolation Voltage(Vrms): 4800Vrms; Sensitivity: 40mV/A; Operating Temperature: -40℃~+150℃; Band Width: 120kHz; Current Terminal Resistance: 1.5mΩ; Response Time (tr): 4us
C22 = CL10A475KO8NNNC: LCSC Part Name: 4.7uF ±10% 16V; Supplier Part: C19666; Manufacturer: SAMSUNG(三星); Supplier Footprint: 0603; JLCPCB Part Class: Basic Part; Datasheet: https://item.szlcsc.com/datasheet/CL10A475KO8NNNC/20375.html; Supplier: LCSC; Tolerance: ±10%; Voltage Rating: 16V; Temperature Coefficient: X5R
C15 C20 C23 C26 = CL10A106MA8NRNC: LCSC Part Name: 10uF ±20% 25V; Supplier Part: C96446; Manufacturer: SAMSUNG(三星); Supplier Footprint: 0603; Datasheet: https://item.szlcsc.com/datasheet/CL10A106MA8NRNC/97651.html; Supplier: LCSC; Tolerance: ±20%; Voltage Rating: 25V; Temperature Coefficient: X5R
L3 = LQM21PN4R7MGRD: LCSC Part Name: 4.7uH ±20%; Supplier Part: C86090; Manufacturer: muRata(村田); Supplier Footprint: 0805; JLCPCB Part Class: Extended Part; Datasheet: https://item.szlcsc.com/datasheet/LQM21PN4R7MGRD/87266.html; Supplier: LCSC; Tolerance: ±20%; Current Rating: 800mA; DC Resistance(DCR): 288mΩ; Frequency - Self Resonant: 30MHz
LED6 = MHK1560CRBTD: LCSC Part Name: 1560直插单灯红色光; Supplier Part: C7470835; Manufacturer: MEIHUA(美华); Supplier Footprint: 插件,P=2.54mm; JLCPCB Part Class: Extended Part; Datasheet: https://item.szlcsc.com/datasheet/MHK1560CRBTD/8521940.html; Supplier: LCSC; Illumination Color: Red; Voltage - Forward(Vf): 1.75V~2.2V; Power(Watts): 80mW; Forward Current: 20mA; Wavelength - Dominant: 632nm; Lens Color: Diffused Red Lens; Luminous Intensity: 50mcd; Viewing Angle: 85°; Operating Temperature: -40℃~+85℃; Note: Switch On
U7 U10 U15 = LTV-817S-TA1-C: LCSC Part Name: DC输入 隔离电压(rms):5000V; Supplier Part: C109227; Manufacturer: LITEON(光宝); Supplier Footprint: SMD-4P; Datasheet: https://item.szlcsc.com/datasheet/LTV-817S-TA1-C/110448.html; Supplier: LCSC; Input type: DC; Output Type: Phototransistor; Voltage - Forward(Vf): 1.2V; Output Current: 50mA; Isolation Voltage(Vrms): 5kV; Reverse Voltage: 6V; Load Voltage: 35V; Number of Outputs: 1; Vce Saturation(VCE(sat)): 100mV@1mA,20mA; Rise time: 4us@2mA,100Ω; Fall time: 3us; Operating Temperature: -30℃~+110℃; Current Transfer Ratio (CTR) Minimum: 50%; Current Transfer Ratio (CTR) Maximum/Saturation Value: 600%; Forward Current(If): 50mA
U11 = B0505LS-1W_C2912569: LCSC Part Name: 1W定电压输入隔离非稳压单路正输出DC-DC模块电源; Supplier Part: C2912569; Manufacturer: DEXU(德旭电子); Manufacturer Part: B0505LS-1W; Supplier Footprint: 插件; Datasheet: https://item.szlcsc.com/datasheet/B0505LS-1W/3195415.html; Supplier: LCSC; Type: Molded type; Number of Outputs: 1; Output Power: 1W; Voltage - Supply: 4.5V~5.5V; Conversion Efficiency: 75%; Output Voltage: 5V; Output Current(Max): 200mA; Capacitive Load(Max): 1000uF; Isolation Voltage(Vrms): 1.5kV; Operating Temperature: -40℃~+85℃; Ripple Noise: 100mVp-p; Voltage Regulation: Non-regulated type
U17 U18 = GAQY216S_C19188663: LCSC Part Name: GAQY216S 1 Form A(SPST-NO) 负载电压:600V 连续负载电流:80mA; Supplier Part: C19188663; Manufacturer: SUPSiC(国晶微半导体); Supplier Footprint: SOP-4; JLCPCB Part Class: Extended Part; Datasheet: https://item.szlcsc.com/datasheet/GAQY216S/20411021.html; Supplier: LCSC; Contact Form: 1A (SPST-NO); Load Current: 80mA; Load Voltage: 600V; Voltage - Forward(Vf): 1.2V; Forward Current(If): 7mA; RDS(on): 35Ω; Isolation Voltage(Vrms): 2.5kV; Turn-on time: 300us; Turn-off time: 20us; Input Type: AC,DC; Operating Temperature: -40℃~+85℃; Total Power Dissipation(Pd): 500mW
LED5 = MHK1560CRBTD: LCSC Part Name: 1560直插单灯红色光; Supplier Part: C7470835; Manufacturer: MEIHUA(美华); Supplier Footprint: 插件,P=2.54mm; JLCPCB Part Class: Extended Part; Datasheet: https://item.szlcsc.com/datasheet/MHK1560CRBTD/8521940.html; Supplier: LCSC; Illumination Color: Red; Voltage - Forward(Vf): 1.75V~2.2V; Power(Watts): 80mW; Forward Current: 20mA; Wavelength - Dominant: 632nm; Lens Color: Diffused Red Lens; Luminous Intensity: 50mcd; Viewing Angle: 85°; Operating Temperature: -40℃~+85℃; Note: Blown Fuse
R17 R39 = 0603WAF1000T5E: LCSC Part Name: 100Ω ±1% 100mW 厚膜电阻; Supplier Part: C22775; Manufacturer: UNI-ROYAL(厚声); Supplier Footprint: 0603; Datasheet: https://atta.szlcsc.com/upload/public/pdf/source/20200306/C422600_1E6D84923E4A46A82E41ADD87F860B5C.pdf; Supplier: LCSC; Type: Thick Film Resistors; Tolerance: ±1%; Temperature Coefficient: ±200ppm/℃; Operating Temperature Range: -55℃~+155℃
R21 R61 = 0603WAF2002T5E: LCSC Part Name: 20kΩ ±1% 100mW 厚膜电阻; Supplier Part: C4184; Manufacturer: UNI-ROYAL(厚声); Supplier Footprint: 0603; Datasheet: https://item.szlcsc.com/datasheet/0603WAF2002T5E/4591.html; Supplier: LCSC; Type: Thick Film Resistor; Tolerance: ±1%; Power(Watts): 100mW; Voltage-Supply(Max): 75V; Temperature Coefficient: ±100ppm/℃; Operating Temperature: -55℃~+155℃
R36 R37 R42 R43 = MFR0S2F4703A20: LCSC Part Name: 470kΩ ±1% 500mW 金属膜电阻 小体积,铜脚，圆柱状直插; Supplier Part: C81750; Manufacturer: UNI-ROYAL(厚声); Supplier Footprint: 插件,D2.7xL9mm; Datasheet: https://item.szlcsc.com/datasheet/MFR0S2F4703A20/82903.html; Supplier: LCSC; Type: Metal Film Resistor; Tolerance: ±1%; Voltage-Supply(Max): 250V; Power(Watts): 500mW; Temperature Coefficient: ±50ppm/℃
R38 R44 = MO2WS-4K7±5%-TT63: LCSC Part Name: 金属氧化膜电阻 4.7kΩ ±5% 2W; Supplier Part: C601835; Manufacturer: VO(翔胜); Supplier Footprint: 插件,D4.5xL11mm; Datasheet: https://item.szlcsc.com/datasheet/MO2WS-4K7%25C2%25B15%2525-TT63/631265.html; Supplier: LCSC; Type: Metal Oxide Film Resistor; Tolerance: ±5%; Voltage-Supply(Max): 400V; Power(Watts): 2W; Temperature Coefficient: ±350ppm/℃; Operating Temperature: -55℃~+155℃
U8 U9 U16 = NE555DR: Supplier Part: C7593; Manufacturer: TI(德州仪器); Supplier Footprint: SOIC-8; Datasheet: https://www.ti.com/cn/lit/gpn/sa555; Supplier: LCSC
LED8 = MHK1560CRBTD: LCSC Part Name: 1560直插单灯红色光; Supplier Part: C7470835; Manufacturer: MEIHUA(美华); Supplier Footprint: 插件,P=2.54mm; JLCPCB Part Class: Extended Part; Datasheet: https://item.szlcsc.com/datasheet/MHK1560CRBTD/8521940.html; Supplier: LCSC; Illumination Color: Red; Voltage - Forward(Vf): 1.75V~2.2V; Power(Watts): 80mW; Forward Current: 20mA; Wavelength - Dominant: 632nm; Lens Color: Diffused Red Lens; Luminous Intensity: 50mcd; Viewing Angle: 85°; Operating Temperature: -40℃~+85℃; Note: Interrupt Indicator
LED9 = MHK1560CYBTD: LCSC Part Name: 1560直插单灯黄色光; Supplier Part: C7470837; Manufacturer: MEIHUA(美华); Supplier Footprint: 插件,P=2.54mm; Datasheet: https://item.szlcsc.com/datasheet/MHK1560CYBTD/8521942.html; Supplier: LCSC; Lamp Holder Type: 5mm round lamp head; Illumination Color: Yellow; Voltage - Forward(Vf): 1.8V~2.4V; Power(Watts): 80mW; Forward Current: 20mA; Wavelength - Dominant: 588nm~596nm; Diode Configuration: Discrete Diode; Lens Color: Frosted Yellow Lens; Luminous Intensity: 50mcd; Viewing Angle: 60°; Operating Temperature: -40℃~+85℃; Note: MCU Indicator
U14 = STM8S003F3P6TR: LCSC Part Name: 主流超值系列8位MCU，具有8 KB Flash、16 MHz CPU和集成EEPROM; Supplier Part: C52717; Manufacturer: ST(意法半导体); Supplier Footprint: TSSOP-20; JLCPCB Part Class: Extended Part; Datasheet: https://item.szlcsc.com/datasheet/STM8S003F3P6TR/53732.html; Supplier: LCSC; CPU Core: STM8; CPU Maximum Speed: 16MHz; Program Storage Size: 8KB; Program Memory Type: FLASH; EEPROM: 128Byte; Number of I/O: 16; ADC (Bit): 10bit; Voltage - Supply: 2.95V~5.5V
CN1 = DS1038-15FBNSiA74-0CC: Connector Type:High Density D-Sub Gender:Female Number of Pins:15P Mounting Type:Right Angle Number of Rows:3 Current Rating-Signal:3A Current Rating-Power:- Voltage Rating:- Color:Black Operating Temperature:-40℃~+105℃ Operating Temperature:-40℃~+105℃; LCSC Part Name: 黑色 1000/盒 D-Sub 母 P数:15P; Supplier Part: C75754; Manufacturer: CONNFLY; Supplier Footprint: 弯插; JLCPCB Part Class: Extended Part; Datasheet: https://item.szlcsc.com/datasheet/DS1038-15FBNSiA74-0CC/76880.html; Supplier: LCSC; Connector Type: High Density D-Sub; Gender: Female; Number of Pins: 15P; Mounting Type: Right Angle; Number of Rows: 3; Current Rating-Signal: 3A; Color: Black; Operating Temperature: -40℃~+105℃
D3 D8 = SRV05-4A_C20615829: LCSC Part Name: 丝印:V05 单向ESD 5V截止 峰值浪涌电流：4A@8/20us; Supplier Part: C20615829; Manufacturer: R+O(宏嘉诚); Supplier Footprint: SOT-23-6L; JLCPCB Part Class: Extended Part; Datasheet: https://item.szlcsc.com/datasheet/SRV05-4A/21980004.html; Supplier: LCSC; Polarity: Unidirectional; Reverse Stand-Off Voltage (Vrwm): 5V; Clamping Voltage: 15V; Peak Pulse Current (Ipp): 4A@8/20us; Peak Pulse Power Dissipation (Ppp): 80W@8/20us; Voltage - Breakdown: 6V; Reverse Leakage Current (Ir): 5uA; Operating Temperature: -55℃~+155℃; level of protection: IEC 61000-4-5；IEC 61000-4-2; Type: ESD; Junction Capacitance: 0.5pF；1pF
LED4 = MHK1560UGBTD: Emitted Color:Emerald Forward Voltage (VF):1.75V~2.2V Forward Voltage (VF):1.75V~2.2V Forward Current:20mA Dominant Wavelength:520nm Dominant Wavelength:520nm Lens Color:雾状绿透镜 Luminous Intensity:1000mcd Luminous Intensity:1000mcd Viewing Angle:85° Operati; LCSC Part Name: 1560直插单灯翠绿色光; Supplier Part: C7470833; Manufacturer: MEIHUA(美华); Supplier Footprint: 插件,P=2.54mm; JLCPCB Part Class: Extended Part; Datasheet: https://atta.szlcsc.com/upload/public/pdf/source/20231114/0151DB1F997DCF286213A722D08B4BAA.pdf; Supplier: LCSC; Emitted Color: Emerald; Forward Voltage (VF): 1.75V~2.2V; Forward Current: 20mA; Dominant Wavelength: 520nm; Lens Color: 雾状绿透镜; Luminous Intensity: 1000mcd; Viewing Angle: 85°; Operating Temperature: -40℃~+85℃; Note: 5v Power
LED10 = MHK1560CYBTD: LCSC Part Name: 1560直插单灯黄色光; Supplier Part: C7470837; Manufacturer: MEIHUA(美华); Supplier Footprint: 插件,P=2.54mm; Datasheet: https://item.szlcsc.com/datasheet/MHK1560CYBTD/8521942.html; Supplier: LCSC; Lamp Holder Type: 5mm round lamp head; Illumination Color: Yellow; Voltage - Forward(Vf): 1.8V~2.4V; Power(Watts): 80mW; Forward Current: 20mA; Wavelength - Dominant: 588nm~596nm; Diode Configuration: Discrete Diode; Lens Color: Frosted Yellow Lens; Luminous Intensity: 50mcd; Viewing Angle: 60°; Operating Temperature: -40℃~+85℃; Note: Access Indicator
SW1-SW3 = MSK12D18G2 125: LCSC Part Name: MSK12D18G2柄靠右; Supplier Part: C19192981; Manufacturer: SHOU HAN(首韩); Supplier Footprint: 插件,P=2.5mm; JLCPCB Part Class: Extended Part; Datasheet: https://item.szlcsc.com/datasheet/MSK12D18G2%2520125/20439169.html; Supplier: LCSC; Circuit: SPDT; Actuator Style: Rectangular Columnar; Length: 9.1mm; Width: 3.5mm; Current Rating: 100mA; Voltage Rating: 12V; Life: 10,000 Cycles; Operating Temperature: -25℃~+70℃
U6 = DS18B20Z(UMW): LCSC Part Name: 温度传感器; Supplier Part: C695837; Manufacturer: UMW(友台半导体); Supplier Footprint: SOIC-8; JLCPCB Part Class: Extended Part; Datasheet: https://atta.szlcsc.com/upload/public/pdf/source/20241210/329D6A12FB6ADF2EBB286F6D44242ED4.pdf; Supplier: LCSC; Resolution: ±0.4℃; Supply Voltage: 2.5V~5.5V
U19 = SP485EEN-L/TR: LCSC Part Name: 增强型低功耗半双工 RS-485 收发器; Supplier Part: C6855; Manufacturer: MaxLinear(迈凌); Supplier Footprint: SOIC-8; Datasheet: https://item.szlcsc.com/datasheet/SP485EEN-L%252FTR/7327.html; Supplier: LCSC; Type: Transceiver; Number of Drivers: 1; Number of Receivers: 1; Voltage - Supply: 4.75V~5.25V; Data Rate: 10Mbps; ESD Protect: ±15kV; Operating Temperature: -40℃~+85℃; Supply Current (Iq): 900uA; Communication Mode: Half-Duplex
LED7 = MHK1560CRBTD: LCSC Part Name: 1560直插单灯红色光; Supplier Part: C7470835; Manufacturer: MEIHUA(美华); Supplier Footprint: 插件,P=2.54mm; JLCPCB Part Class: Extended Part; Datasheet: https://item.szlcsc.com/datasheet/MHK1560CRBTD/8521940.html; Supplier: LCSC; Illumination Color: Red; Voltage - Forward(Vf): 1.75V~2.2V; Power(Watts): 80mW; Forward Current: 20mA; Wavelength - Dominant: 632nm; Lens Color: Diffused Red Lens; Luminous Intensity: 50mcd; Viewing Angle: 85°; Operating Temperature: -40℃~+85℃; Note: Welded Contacts

## Nets
12V-CHECK: R60.1 R61.2
+5V: C14.2 C17.2 C19.2 C25.2 C28.2 C31.2 C32.2 CN1.6 CN1.13 D3.5(VP) D3.6(I/O) D8.5(VP) L3.1 R5.2 R16.2 R18.2 R20.2 R25.2 R27.2 R28.2 R29.2 R40.2 R45.2 R49.2 R50.2 SW1.3 SW2.3 SW3.3 U6.3(VDD) U8.4(RST) U8.8(VCC) U9.4(RST) U9.8(VCC) U16.4(RST) U16.8(VCC) U19.8(VCC) U21.1(VCC)
+12V: C34.1 CN1.4 CN1.5 D2.1(C) D4.1(K) K1.2 R15.1 R61.1 U2.5(OUT) U2.6(OUT) U2.7(OUT) U2.8(OUT)
GND: C3.1 C4.2 C6.1 C14.1 C15.1 C16.1 C17.1 C18.1 C19.1 C20.1 C23.1 C24.2 C25.1 C26.1 C27.1 C28.1 C31.1 C32.1 C33.1 C34.2 CN1.3 CN1.10 CN1.11 CN1.14 D1.2(A) D3.2(VN) D4.2(A) D8.2(VN) LED3.1(K) LED4.1(K) LED8.1(K) LED9.2(K) Q1.2(S) Q3.2(S) Q4.2(S) Q6.2(S) R8.1 R26.1 R30.1 R47.1 R58.1 R59.1 R60.2 U1.4(Vo-) U2.2(GND) U6.5(GND) U7.3 U8.1(GND) U9.1(GND) U10.3 U11.2(GND) U15.3 U16.1(GND) U19.5(GND) U21.2(GND)
485-A: CN1.8 D8.1(I/O) D8.6(I/O) U19.6(A)
485-B: CN1.9 D8.3(I/O) D8.4(I/O) U19.7(B)
ACCESS: CN1.1 D3.4(I/O) Q1.1(G) Q6.1(G) R47.2
DE: U19.3(DE)
DI: U19.4(DI)
DISABLE-ANTI-RESTART: SW2.2
DISABLE-CURRENT-WARN: SW3.2
EARTH: C1.1 C5.2 CN2.3 CN3.2(E)
FLASH-SOURCE: SW1.1 U9.3(OUT)
FLASHING: R19.2 R32.2 R46.2 SW1.2
FUSE-BLOWN: R25.1 U8.7(DISCH)
FUSEDET: C21.2 FH2.1 R36.1 U21.4(IP+)
IMON: C33.2 R55.1
INTERRUPT: CN1.7 D3.3(I/O) Q3.3(D)
ISO-5V: C22.2 R51.2 R52.2 R53.2 R54.2 U11.6(+VO) U18.4
ISO-GND: C22.1 C24.1 R51.1 R52.1 R53.1 R54.1 U10.2 U11.4(0V)
LIVE: CN3.3(L) FH1.2 FH2.2
MCU-INDICATOR: R56.2
MCU-SWITCH: Q2.1(G) R8.2
NEUTRAL: C2.2 CN2.1 CN3.1(N) D6.2(A) D7.2(A) L1.1 R1.2 R48.1 U7.2 U15.2 U17.3
ONEWIRE: CN1.2 D3.1(I/O) U6.4(DQ)
RE: U19.2(RE#)
RO: U19.1(RO)
SWITCH-ISO: Q4.1(G) R30.2
SWITCH-MIRROR: Q5.2(S)
SWITCH-ON: LED6.1(K) R27.1 U10.4
WELD-DET: C29.2 CN2.2 K1.4 R42.1 R48.2 U18.3
WELDED: R45.1 U16.7(DISCH)
WRITE-INTERRUPT: Q3.1(G) R26.2 R57.2
$1N1792: D2.2(A) K1.1 Q2.3(D)
$1N3074: C1.2 L1.3 U1.2(L)
$1N3080: C5.1 L1.4 U1.1(N)
$1N3148: C3.2 C4.1 D1.1(K) R2.2 U1.6(Vo+) U2.3(IN) U2.4(IN)
$1N3585: C6.2 R2.1 U2.1(VS)
$1N20815: C2.1 FH1.1 L2.1 R1.1
$1N20816: L1.2 L2.2
$1N22595: LED3.2(A) R15.2
$1N27753: Q2.2(S) Q6.3(D)
$1N27894: K1.3 U21.5(IP-)
$1N29987: R55.2 U21.3(VOUT)
$2N1040: LED5.2(A) R19.1
$2N1041: LED5.1(K) U8.3(OUT)
$2N1042: C16.2 U8.5(CONT)
$2N1044: C15.2 R17.2 R18.1 U8.2(TRIG) U8.6(THRES)
$2N1059: R17.1 U7.4
$2N1063: D6.1(C) R38.2 U7.1
$2N2500: R36.2 R37.1
$2N2514: C21.1 R37.2 R38.1
$2N3110: R20.1 R21.2 U9.7(DISCH)
$2N3114: C18.2 U9.5(CONT)
$2N3115: C20.2 R21.1 U9.2(TRIG) U9.6(THRES)
$3N811: LED4.2(A) R16.1
$3N3927: LED10.1(A) R5.1
$3N3929: LED10.2(K) Q1.3(D)
$3N4280: R59.2 SW2.1
$3N4284: R58.2 SW3.1
$4N1779: LED9.1(A) R56.1
$4N1823: LED8.2(A) R57.1
$5N601: R28.1 R50.1 U17.1
$5N659: R29.1 R49.1 U18.1
$5N709: Q4.3(D) U17.2 U18.2
$5N916: R31.2 U10.1
$5N1162: C23.2 L3.2 U11.1(VIN)
$5N1411: LED6.2(A) R32.1
$5N3978: R31.1 U17.4
$7N1010: D7.1(C) R44.2 U15.1
$7N1018: C27.2 U16.5(CONT)
$7N1023: C29.1 R43.2 R44.1
$7N1029: R42.2 R43.1
$7N1032: R39.1 U15.4
$7N1035: C26.2 R39.2 R40.1 U16.2(TRIG) U16.6(THRES)
$7N1274: Q5.1(G) U16.3(OUT)
$7N1366: LED7.2(A) R46.1
$7N1428: LED7.1(K) Q5.3(D)

Not connected (* = marked no-connect by the designer): CN1 12* 15* 16* 17*; U6 1(NC)* 2(NC)* 6(NC)* 7(NC)* 8(NC)*; U14 1(UART1_CK/TIM2_CH1/BEEP/(HS)PD4) 2(UART1_TX/AIN5/(HS) PD5) 3(UART1_RX/AIN6/(HS) PD6) 4(NRST) 5(OSCIN/PA1) 6(OSCOUT/PA2) 7(VSS) 8(VCAP) 9(VDD) 10([SPI_NSS] TIM2_CH3/(HS) PA3) 11(PB5 (T)/I 2 C_SDA [TIM1_BKIN]) 12(PB4 (T)/I 2 C_SCL [ADC_ETR]) 13(PC3 (HS)/TIM1_CH3 [TLI] [TIM1_CH1N]) 14(PC4 (HS) /TIM1_CH4/CLK_CCO/AIN2/[TIM1_CH2N]) 15(PC5 (HS)/SPI_SCK [TIM2_CH1]) 16(PC6 (HS)/SPI_MOSI [TIM1_CH1]) 17(PC7 (HS) /SPI_MISO [TIM1_CH2]) 18(PD1(HS)/SWIM) 19(PD2 (HS)/AIN3/[TIM2_CH3]) 20(PD3 (HS)/AIN4/TIM2_CH2/ADC_ETR)

## Notes on the sheets
sheet 1
- ACS AC Power Switch
- C13 inlet to 5-15R outlet for 1 device
- Harvest 12v 1.67A for high-power deployments (blast gates etc.)
- Monitor for blown fuse with watchdog
- Assert interrupt if blown
- Monitor for anti-restart
- Assert interrupt otherwise
- i.e. make sure machine switch is "off" before turning on
- Designed for up to 20A constant current
- Relay rated for highly inductive loads, like motors
- AC-DC Power Supply: 12v @ 1.67A
- Power, Access, Fuse lights
- Ideal Diode to 12V Rail
- Fuse light flashes when blown
- Power Switching & Output Port
- Power Input
sheet 2
- Blown Fuse Detector
- 555 timer reset by every 60Hz pulse of the input power
- If a pulse is missed, sets FUSE-BLOWN low
- Another 555 provides a flashing light indicator
- Flashing Light Controller
- Blown Fuse Detector
- Skipped Pulse Detector
sheet 3
- ESD Protection
- Bus 15P Connection
- 1: Flashing or solid warning lights
- Configuration Switches
- 2: Diable Anti-Restart Detection
- 3: Disable high-current shutoff warning
- RS485 to communicate with Core
- State the reason for an interrupt
- Allows programatic disabling of Anti-Restart
- OneWire Identification ROM & Temperature Sensor
sheet 5
- Anti-Restart Detector
- Watches for machine power switch left on
- Isolated power supply flows through NEMA 5-15 when not energized
- If detected by Optocoupler, machine switch is turned on still
- Isolate the power supply, optocoupler from AC before switching relay
- Flashing indicator light borrows source from blown fuse detect
- Pulls SWITCH-ON low if switch is still detected
- 20mA Constant Load
- Stabilize output of isolated supply
- "WELD-DET" is "LIVE" on the far side of the relay
sheet 6
- Welded Contact Detect
- Never happened in testing, but welded contacts represent a potential safety issue
- Repurpose circuit from the blown fuse detector, look for AC on the far side of relay
- Flashing light only turned on if the MCU thinks the relay should be on
- Repurposes flashing 555 from blown fuse detect
- Welded Contact Detector
- Skipped Pulse Detector
